# EAGLE design quadcopter (EAGLE 8.1.1)
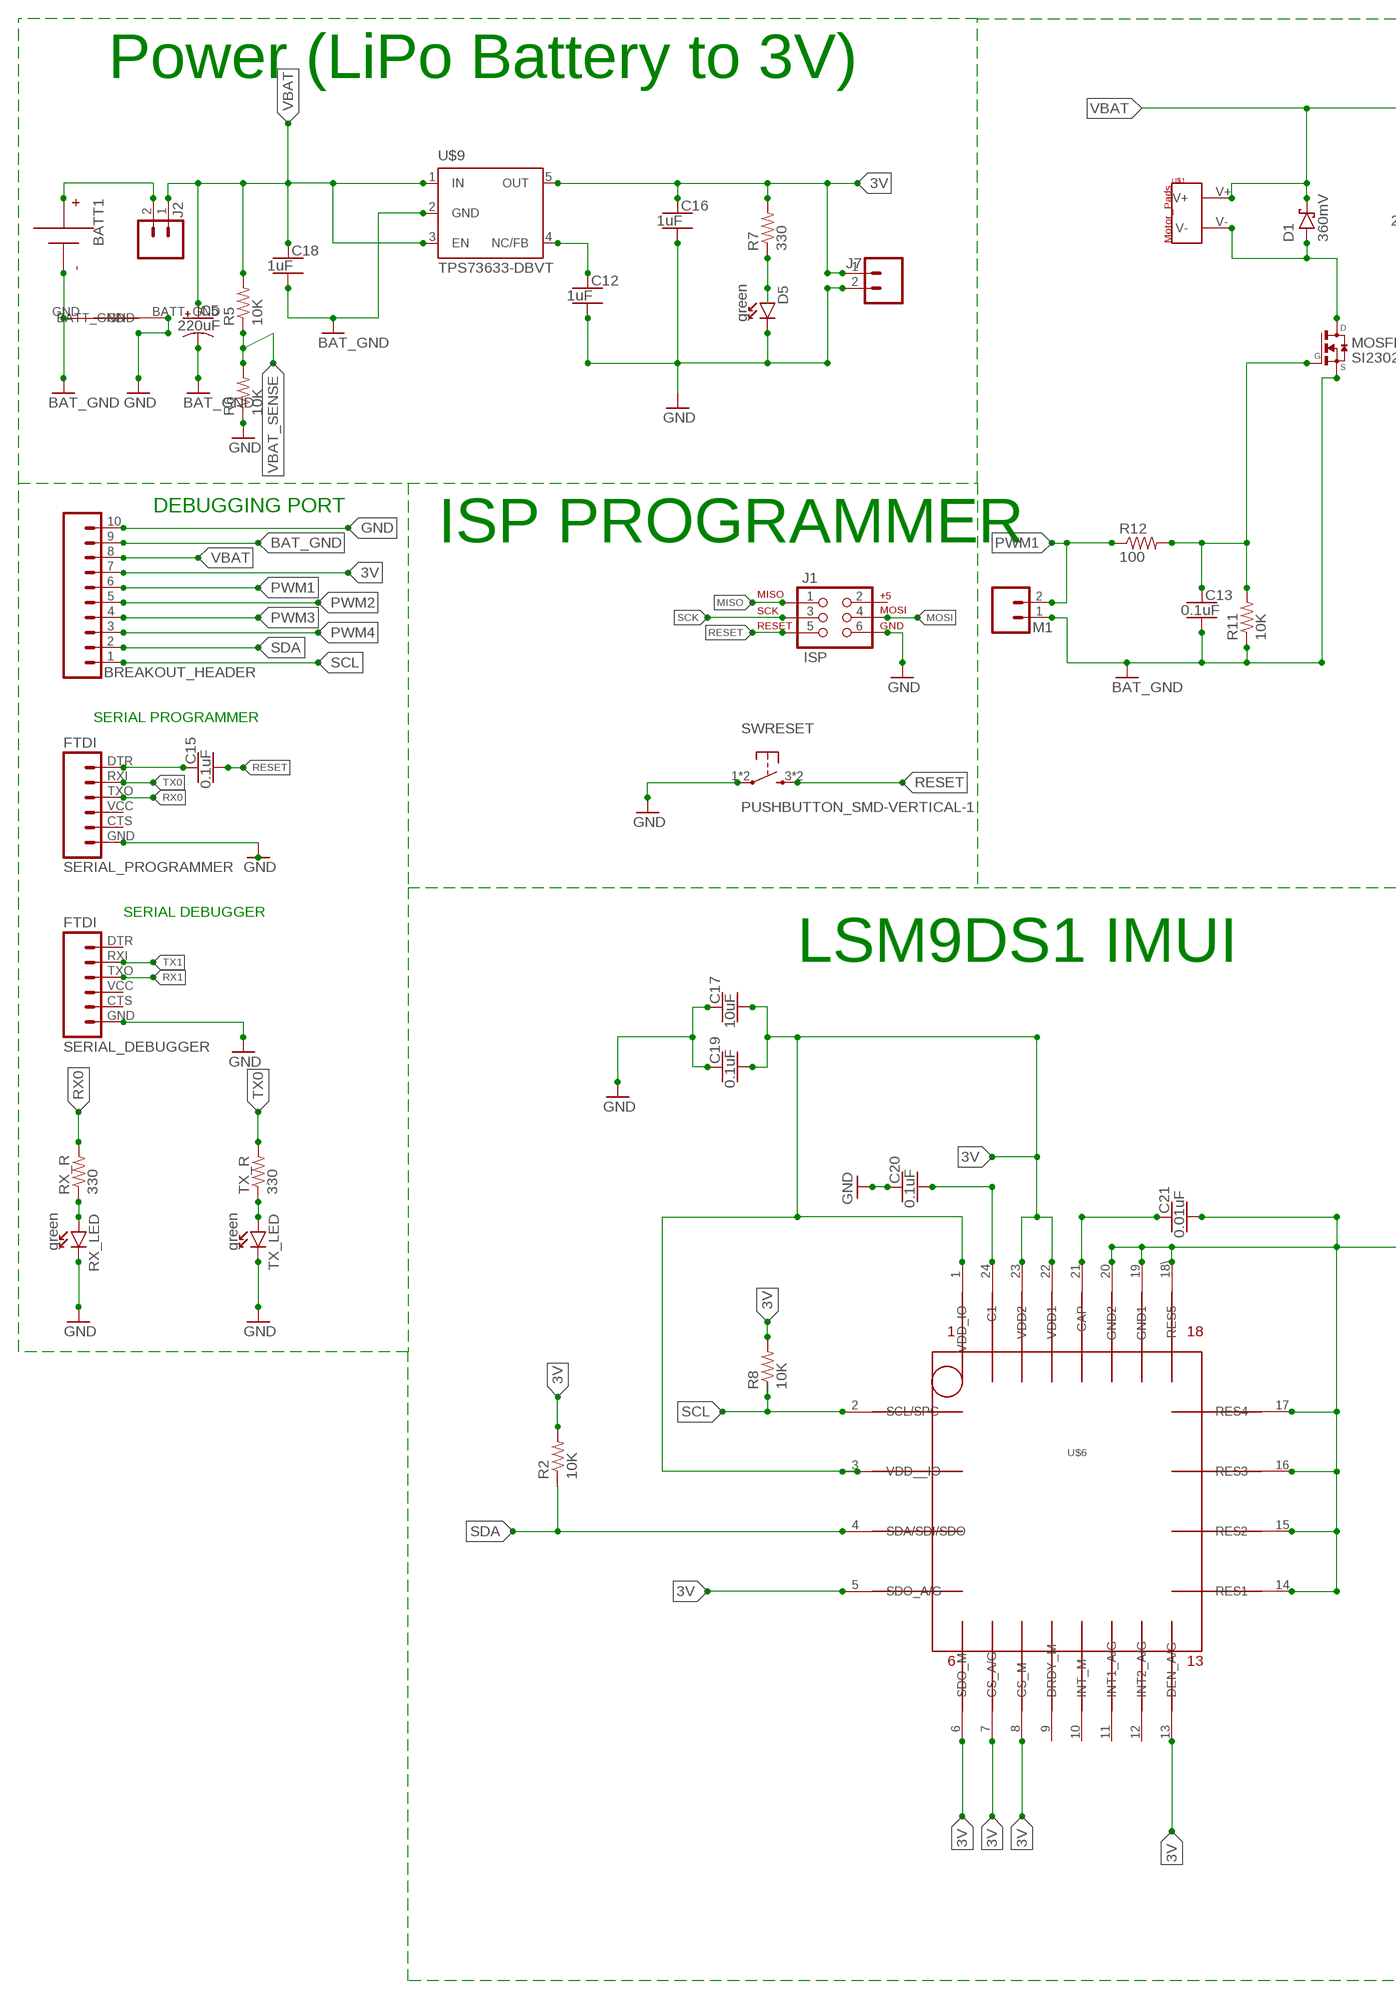
[diagram p0: schematic, sheet 1, part 1 of 2]
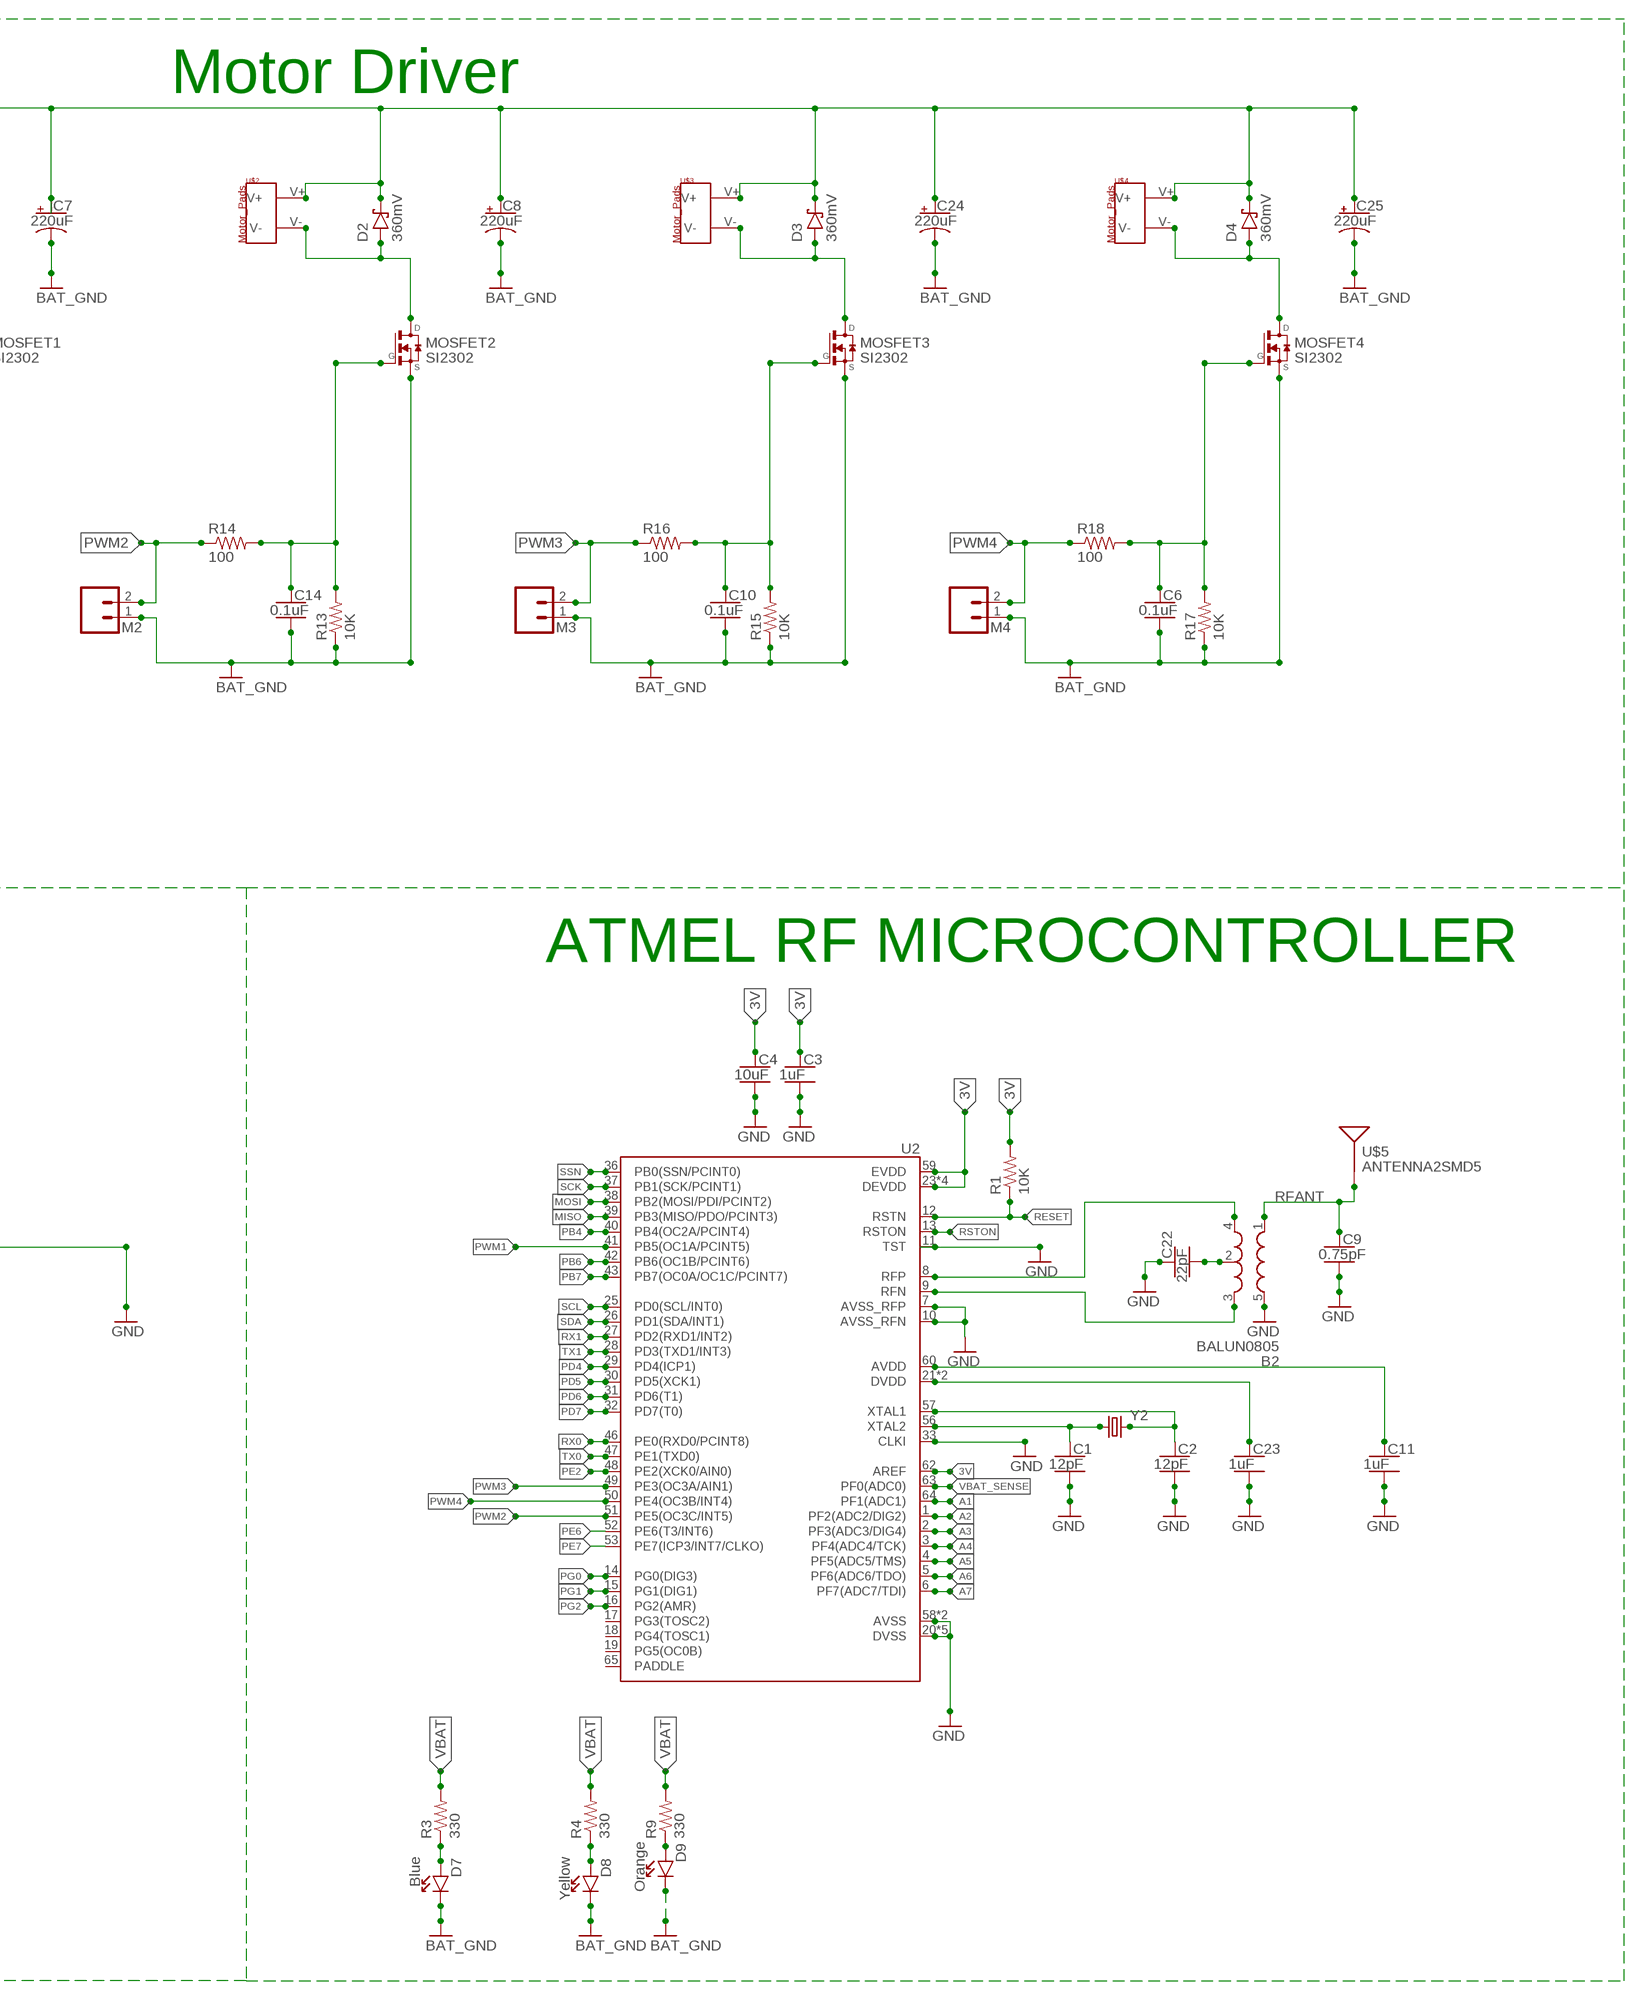
[diagram p1: schematic, sheet 1, part 2 of 2]

## Parts
B2  BALUN0805  [BALUN]
BATT1  BATTERY-HUBSAN-W/HOLDER  [BATTERY-W/HOLDER-380MAH-HUBSAN]
BREAKOUT_HEADER  SIP-10_TH-254X10  [HDRV10W63P254_10X1_2540X254H838_HS]
C1  12pF  CAPACITOR-NP_SMD-2012-0805_CERAMIC-12PF  [CAPC2012X140_HS]
C2  12pF  CAPACITOR-NP_SMD-2012-0805_CERAMIC-12PF  [CAPC2012X140_HS]
C3  1uF  CAPACITOR-NP_SMD-2012-0805_CERAMIC-1UF  [CAPC2012X140_HS]
C4  10uF  CAPACITOR-NP_SMD-2012-0805_CERAMIC-10UF  [CAPC2012X140_HS]
C5  220uF  CAPACITOR-POL_SMD-7043-D_TANTALUM-220UF  [CAPMP7343X310_HS]
C6  0.1uF  CAPACITOR-NP_SMD-2012-0805_CERAMIC-0.1UF  [CAPC2012X140_HS]
C7  220uF  CAPACITOR-POL_SMD-7043-D_TANTALUM-220UF  [CAPMP7343X310_HS]
C8  220uF  CAPACITOR-POL_SMD-7043-D_TANTALUM-220UF  [CAPMP7343X310_HS]
C9  0.75pF  CAPACITOR-NP_SMD-2012-0805_CERAMIC-0.75PF  [CAPC2012X140_HS]
C10  0.1uF  CAPACITOR-NP_SMD-2012-0805_CERAMIC-0.1UF  [CAPC2012X140_HS]
C11  1uF  CAPACITOR-NP_SMD-2012-0805_CERAMIC-1UF  [CAPC2012X140_HS]
C12  1uF  CAPACITOR-NP_SMD-2012-0805_CERAMIC-1UF  [CAPC2012X140_HS]
C13  0.1uF  CAPACITOR-NP_SMD-2012-0805_CERAMIC-0.1UF  [CAPC2012X140_HS]
C14  0.1uF  CAPACITOR-NP_SMD-2012-0805_CERAMIC-0.1UF  [CAPC2012X140_HS]
C15  0.1uF  CAPACITOR-NP_SMD-2012-0805_CERAMIC-0.1UF  [CAPC2012X140_HS]
C16  1uF  CAPACITOR-NP_SMD-2012-0805_CERAMIC-1UF  [CAPC2012X140_HS]
C17  10uF  CAPACITOR-NP_SMD-2012-0805_CERAMIC-10UF  [CAPC2012X140_HS]
C18  1uF  CAPACITOR-NP_SMD-2012-0805_CERAMIC-1UF  [CAPC2012X140_HS]
C19  0.1uF  CAPACITOR-NP_SMD-2012-0805_CERAMIC-0.1UF  [CAPC2012X140_HS]
C20  0.1uF  CAPACITOR-NP_SMD-2012-0805_CERAMIC-0.1UF  [CAPC2012X140_HS]
C21  0.01uF  CAPACITOR-NP_SMD-2012-0805_CERAMIC-0.01UF  [CAPC2012X140_HS]
C22  22pF  CAPACITOR-NP_SMD-2012-0805_CERAMIC-22PF  [CAPC2012X140_HS]
C23  1uF  CAPACITOR-NP_SMD-2012-0805_CERAMIC-1UF  [CAPC2012X140_HS]
C24  220uF  CAPACITOR-POL_SMD-7043-D_TANTALUM-220UF  [CAPMP7343X310_HS]
C25  220uF  CAPACITOR-POL_SMD-7043-D_TANTALUM-220UF  [CAPMP7343X310_HS]
D1  360mV  DIODE-SCHOTTKY_SMD-SOD123-360MV  [SOD3716X135_HS]
D2  360mV  DIODE-SCHOTTKY_SMD-SOD123-360MV  [SOD3716X135_HS]
D3  360mV  DIODE-SCHOTTKY_SMD-SOD123-360MV  [SOD3716X135_HS]
D4  360mV  DIODE-SCHOTTKY_SMD-SOD123-360MV  [SOD3716X135_HS]
D5  green  DIODE-LED_SMD-2012-0805-GREEN  [LEDSC125X200X120-2_HS]
D7  Blue  DIODE-LED_SMD-2012-0805  [LEDSC125X200X120-2_HS]
D8  Yellow  DIODE-LED_SMD-2012-0805  [LEDSC125X200X120-2_HS]
D9  Orange  DIODE-LED_SMD-2012-0805  [LEDSC125X200X120-2_HS]
J1  ISP  AVR_SPI_PRG_6NS  [2X3-NS]
J2  MALE_HEADER_2POS-2X1-0.1IN  [MALE_HEADER_2X1_0.1IN]
J7  MALE_HEADER_2POS-2X1-0.1IN  [MALE_HEADER_2X1_0.1IN]
M1  MALE_HEADER_2POS-2X1-0.1IN  [MALE_HEADER_2X1_0.1IN]
M2  MALE_HEADER_2POS-2X1-0.1IN  [MALE_HEADER_2X1_0.1IN]
M3  MALE_HEADER_2POS-2X1-0.1IN  [MALE_HEADER_2X1_0.1IN]
M4  MALE_HEADER_2POS-2X1-0.1IN  [MALE_HEADER_2X1_0.1IN]
MOSFET1  SI2302  [SOT23]
MOSFET2  SI2302  [SOT23]
MOSFET3  SI2302  [SOT23]
MOSFET4  SI2302  [SOT23]
R1  10K  RESISTOR_SMD-2012-0805-10K  [RESC2012X60_HS]
R2  10K  RESISTOR_SMD-2012-0805-10K  [RESC2012X60_HS]
R3  330  RESISTOR_SMD-2012-0805-330  [RESC2012X60_HS]
R4  330  RESISTOR_SMD-2012-0805-330  [RESC2012X60_HS]
R5  10K  RESISTOR_SMD-2012-0805-10K  [RESC2012X60_HS]
R6  10K  RESISTOR_SMD-2012-0805-10K  [RESC2012X60_HS]
R7  330  RESISTOR_SMD-2012-0805-330  [RESC2012X60_HS]
R8  10K  RESISTOR_SMD-2012-0805-10K  [RESC2012X60_HS]
R9  330  RESISTOR_SMD-2012-0805-330  [RESC2012X60_HS]
R11  10K  RESISTOR_SMD-2012-0805-10K  [RESC2012X60_HS]
R12  100  RESISTOR_SMD-2012-0805-100  [RESC2012X60_HS]
R13  10K  RESISTOR_SMD-2012-0805-10K  [RESC2012X60_HS]
R14  100  RESISTOR_SMD-2012-0805-100  [RESC2012X60_HS]
R15  10K  RESISTOR_SMD-2012-0805-10K  [RESC2012X60_HS]
R16  100  RESISTOR_SMD-2012-0805-100  [RESC2012X60_HS]
R17  10K  RESISTOR_SMD-2012-0805-10K  [RESC2012X60_HS]
R18  100  RESISTOR_SMD-2012-0805-100  [RESC2012X60_HS]
RX_LED  green  DIODE-LED_SMD-2012-0805-GREEN  [LEDSC125X200X120-2_HS]
RX_R  330  RESISTOR_SMD-2012-0805-330  [RESC2012X60_HS]
SERIAL_DEBUGGER  FTDI  FTDI_BASICPTH  [FTDI_BASIC]
SERIAL_PROGRAMMER  FTDI  FTDI_BASICPTH  [FTDI_BASIC]
SWRESET  PUSHBUTTON_SMD-VERTICAL-1  [TE_FSM8JSMA_HS]
TX_LED  green  DIODE-LED_SMD-2012-0805-GREEN  [LEDSC125X200X120-2_HS]
TX_R  330  RESISTOR_SMD-2012-0805-330  [RESC2012X60_HS]
U2  ATMEGA128RFA1  [QFN-64]
U$1  MOTOR_PADS  [MOTOR_PADS]
U$2  MOTOR_PADS  [MOTOR_PADS]
U$3  MOTOR_PADS  [MOTOR_PADS]
U$4  MOTOR_PADS  [MOTOR_PADS]
U$5  ANTENNA2SMD5  [ANTENNA-CHIP5]
U$6  IMULAST  [LGA-24/4MM]
U$7  WIRE_BRIDGE  [WIRE_BRIGE]
U$9  TPS73633-DBVT  [SOT23-DBV]
Y2  CRYSTAL5X3  [CRYSTAL-SMD-5X3]

## Nets
3V: BREAKOUT_HEADER.7 C3.1 C4.1 C16.1 C17.2 C19.2 J7.1 R1.2 R2.2 R7.2 R8.2 U2.23(DEVDD) U2.34(DEVDD) U2.44(DEVDD) U2.54(DEVDD) U2.59(EVDD) U2.62(AREF) U$6.1(VDD_IO) U$6.3(VDD__IO) U$6.5(SDO_A/G) U$6.6(SDO_M) U$6.7(CS_A/G) U$6.8(CS_M) U$6.13(DEN_A/G) U$6.22(VDD1) U$6.23(VDD2) U$9.5(OUT)
A1: U2.64(PF1(ADC1))
A2: U2.1(PF2(ADC2/DIG2))
A3: U2.2(PF3(ADC3/DIG4))
A4: U2.3(PF4(ADC4/TCK))
A5: U2.4(PF5(ADC5/TMS))
A6: U2.5(PF6(ADC6/TDO))
A7: U2.6(PF7(ADC7/TDI))
AVDD: C11.1 U2.60(AVDD)
BAT_GND [RFSIG]: BATT1.-(N) BREAKOUT_HEADER.9 C5.2(-) C6.2 C7.2(-) C8.2(-) C10.2 C13.2 C14.2 C18.2 C24.2(-) C25.2(-) D7.C D8.C D9.C M1.1 M2.1 M3.1 M4.1 MOSFET1.2(S) MOSFET2.2(S) MOSFET3.2(S) MOSFET4.2(S) R11.1 R13.1 R15.1 R17.1 U$7.GND U$9.2(GND)
DTR: C15.1 SERIAL_PROGRAMMER.DTR
DVDD: C23.1 U2.21(DVDD) U2.22(DVDD)
GND [HighAmps]: B2.5(GND) BREAKOUT_HEADER.10 C1.2 C2.2 C3.2 C4.2 C9.2 C11.2 C12.2 C16.2 C17.1 C19.1 C20.1 C21.2 C22.1 C23.2 D5.C J1.6 J7.2 R6.1 RX_LED.C SERIAL_DEBUGGER.GND SERIAL_PROGRAMMER.GND SWRESET.1 SWRESET.2 TX_LED.C U2.7(AVSS_RFP) U2.10(AVSS_RFN) U2.11(TST) U2.20(DVSS) U2.24(DVSS) U2.33(CLKI) U2.35(DVSS) U2.45(DVSS) U2.55(DVSS) U2.58(AVSS) U2.61(AVSS) U$6.14(RES1) U$6.15(RES2) U$6.16(RES3) U$6.17(RES4) U$6.18\(RES5) U$6.19(GND1) U$6.20(GND2) U$7.BATT_GND
MISO: J1.1 U2.39(PB3(MISO/PDO/PCINT3))
MOSI: J1.4 U2.38(PB2(MOSI/PDI/PCINT2))
N$2 [HighAmps]: C13.1 MOSFET1.1(G) R11.2 R12.2
N$3: C2.1 U2.57(XTAL1) Y2.3
N$4: C1.1 U2.56(XTAL2) Y2.1
N$7 [HighAmps]: B2.2(GND) C22.2
N$9: D9.A R9.1
N$14 [HighAmps]: D1.A MOSFET1.3(D) U$1.V-
N$17 [RFSIG]: BATT1.+(P) J2.2
N$18: D5.A R7.1
N$19 [HighAmps]: D2.A MOSFET2.3(D) U$2.V-
N$21: TX_LED.A TX_R.1
N$22: RX_LED.A RX_R.1
N$23: C20.2 U$6.24(C1)
N$24 [HighAmps]: D3.A MOSFET3.3(D) U$3.V-
N$26: C12.1 U$9.4(NC/FB)
N$27: D8.A R4.1
N$28: D7.A R3.1
N$29 [HighAmps]: D4.A MOSFET4.3(D) U$4.V-
N$33: C21.1 U$6.21(CAP)
N$48 [RFSIG]: C14.1 MOSFET2.1(G) R13.2 R14.2
N$50: C10.1 MOSFET3.1(G) R15.2 R16.2
N$52 [RFSIG]: C6.1 MOSFET4.1(G) R17.2 R18.2
PB4: U2.40(PB4(OC2A/PCINT4))
PB6: U2.42(PB6(OC1B/PCINT6))
PB7: U2.43(PB7(OC0A/OC1C/PCINT7))
PD4: U2.29(PD4(ICP1))
PD5: U2.30(PD5(XCK1))
PD6: U2.31(PD6(T1))
PD7: U2.32(PD7(T0))
PE2: U2.48(PE2(XCK0/AIN0))
PE6: U2.52(PE6(T3/INT6))
PE7: U2.53(PE7(ICP3/INT7/CLKO))
PG0: U2.14(PG0(DIG3))
PG1: U2.15(PG1(DIG1))
PG2: U2.16(PG2(AMR))
PWM1: BREAKOUT_HEADER.6 M1.2 R12.1 U2.41(PB5(OC1A/PCINT5))
PWM2: BREAKOUT_HEADER.5 M2.2 R14.1 U2.51(PE5(OC3C/INT5))
PWM3: BREAKOUT_HEADER.4 M3.2 R16.1 U2.49(PE3(OC3A/AIN1))
PWM4: BREAKOUT_HEADER.3 M4.2 R18.1 U2.50(PE4(OC3B/INT4))
RESET: C15.2 J1.5 R1.1 SWRESET.3 SWRESET.4 U2.12(RSTN)
RFANT [RFSIG]: B2.1(IN) C9.1 U$5.FEED(SIGNAL)
RFN [HighAmps]: B2.3(OUT2) U2.9(RFN)
RFP [HighAmps]: B2.4(OUT1) U2.8(RFP)
RSTON: U2.13(RSTON)
RX0: RX_R.2 SERIAL_PROGRAMMER.TXO U2.46(PE0(RXD0/PCINT8))
RX1: SERIAL_DEBUGGER.TXO U2.27(PD2(RXD1/INT2))
SCK: J1.3 U2.37(PB1(SCK/PCINT1))
SCL: BREAKOUT_HEADER.1 R8.1 U2.25(PD0(SCL/INT0)) U$6.2(SCL/SPC)
SDA: BREAKOUT_HEADER.2 R2.1 U2.26(PD1(SDA/INT1)) U$6.4(SDA/SDI/SDO)
SSN: U2.36(PB0(SSN/PCINT0))
TX0: SERIAL_PROGRAMMER.RXI TX_R.2 U2.47(PE1(TXD0))
TX1: SERIAL_DEBUGGER.RXI U2.28(PD3(TXD1/INT3))
VBAT [RFSIG]: BREAKOUT_HEADER.8 C5.1(+) C7.1(+) C8.1(+) C18.1 C24.1(+) C25.1(+) D1.C D2.C D3.C D4.C J2.1 R3.2 R4.2 R5.2 R9.2 U$1.V+ U$2.V+ U$3.V+ U$4.V+ U$9.1(IN) U$9.3(EN)
VBAT_SENSE [RFSIG]: R5.1 R6.2 U2.63(PF0(ADC0))
Unconnected: J1.2 SERIAL_DEBUGGER.CTS SERIAL_DEBUGGER.DTR SERIAL_DEBUGGER.VCC SERIAL_PROGRAMMER.CTS SERIAL_PROGRAMMER.VCC U2.17(PG3(TOSC2)) U2.18(PG4(TOSC1)) U2.19(PG5(OC0B)) U2.65(PADDLE) U$6.9(DRDY_M) U$6.10(INT_M) U$6.11(INT1_A/G) U$6.12(INT2_A/G)

## Notes on the sheet
- Power (LiPo Battery to 3V) | Motor Driver
- DEBUGGING PORT
- ISP PROGRAMMER
- SERIAL PROGRAMMER
- SERIAL DEBUGGER
- LSM9DS1 IMUI | ATMEL RF MICROCONTROLLER

## Library data of the parts
B2 = quadparts_prebuilt:BALUN: 0805 footprint balun- Ember 351/357; DATASHEET: http://katalog.we-online.de/pbs/datasheet/748421245.pdf; DIST: Digikey; DISTPN: 732-2230-6-ND; MFR: Wurth Electronics Inc; MPN: 748421245; PRICE: 2.63
BATT1 = quadparts_prebuilt:BATTERY; CREATOR: Swanson; DIST: AMAZON; DISTPN: http://www.amazon.com/dp/B00RROB6Q4?smid=AMNTPWSAB5H0S; MFR: HUBSAN; MPN: X4-H107C-8-in-1
BREAKOUT_HEADER = quadparts_prebuilt:SIP-10_: 10 pin single inline pin header, socket, or connector; DATASHEET: http://portal.fciconnect.com/Comergent//fci/drawing/68000.pdf; DIST: Digikey; DISTPN: 609-3250-ND; MFR: Amphenol FCI; MPN: 68000-110HLF; PRICE: 0.55
C1 C2 = quadparts_prebuilt:CAPACITOR-NP_: Nonpolarized capacitor; DIST: Digikey; DISTPN: 490-5531-1-ND; MFR: Murata Electronics North America; MPN: GRM21A5C2E120JW01D
C3 C11 C12 C16 C18 C23 = quadparts_prebuilt:CAPACITOR-NP_: Nonpolarized capacitor; DIST: Digikey; DISTPN: 490-4736-1-ND; MFR: Murata Electronics North America; MPN: GRM21BR71H105KA12L
C4 C17 = quadparts_prebuilt:CAPACITOR-NP_: Nonpolarized capacitor; DIST: Digikey; DISTPN: 490-5523-1-ND; MFR: Murata Electronics North America; MPN: GRM21BR61E106KA73L
C5 C7 C8 C24 C25 = quadparts_prebuilt:CAPACITOR-POL_: Polarized capacitor; DIST: Digikey; DISTPN: 478-8912-1-ND; MFR: AVX Corporation; MPN: TAJD227K006RNJ
C6 C10 C13-C15 C19 C20 = quadparts_prebuilt:CAPACITOR-NP_: Nonpolarized capacitor; DIST: Digikey; DISTPN: 490-1666-1-ND; MFR: Murata Electronics North America; MPN: GRM21BR71H104KA01L
C9 = quadparts_prebuilt:CAPACITOR-NP_: Nonpolarized capacitor; DIST: Digikey; DISTPN: 490-3585-1-ND; MFR: Murata Electronics North America; MPN: GQM2195C2AR75CB01D
C21 = quadparts_prebuilt:CAPACITOR-NP_: Nonpolarized capacitor; DIST: Digikey; DISTPN: 490-8295-1-ND; MFR: Murata Electronics North America; MPN: GRM2195C1H103FA01D
C22 = quadparts_prebuilt:CAPACITOR-NP_: Nonpolarized capacitor; DIST: Digikey; DISTPN: 490-5534-1-ND; MFR: Murata Electronics North America; MPN: GRM21A5C2E220JW01D
D1-D4 = quadparts_prebuilt:DIODE-SCHOTTKY_: Schottky diode; DIST: Digikey; DISTPN: CRS08QMCT-ND; MFR: Toshiba Semiconductor and Storage; MPN: CRS08(TE85L,Q,M)
D5 RX_LED TX_LED = quadparts_prebuilt:DIODE-LED_: Light emitting diode; DIST: Digikey; DISTPN: 160-1179-1-ND; MFR: Lite-On Inc; MPN: LTST-C170GKT
D7-D9 = quadparts_prebuilt:DIODE-LED_: Light emitting diode
J1 = SparkFun-Connectors:AVR_SPI_PRG_6: AVR ISP 6 Pin This is the reduced ISP connector for AVR programming. Common on Arduino. This footprint will take up less PCB space and can be used with a 10-pin to 6-pin adapter such as SKU: BOB-08508
J2 J7 M1-M4 = quadparts_prebuilt:MALE_HEADER_2POS: 2 pin single inline pin header, socket, or connector; CREATOR: SWANSON; DIST: Digikey; DISTPN: 3M9447-ND; MFR: 3M; MPN: 961102-6404-AR
MOSFET1-MOSFET4 = quadparts_prebuilt:SI2302: MOSFET N-Channel 20 V (D-S); AVAILABILITY: Good; DESCRIPTION: Single N-Channel 20 V 0.057 Ohm 0.71 W Surface Mount Power Mosfet - SOT-23-3; MF: Vishay Siliconix; MP: SI2302CDS-T1-E3; PACKAGE: SOT-23-3 Vishay Siliconix; PRICE: 0.19 USD
R1 R2 R5 R6 R8 R11 R13 R15 R17 = quadparts_prebuilt:RESISTOR_: Resistor; DIST: Digikey; DISTPN: 311-10KARCT-ND; MFR: Yageo; MPN: RC0805JR-0710KL
R3 R4 R7 R9 RX_R TX_R = quadparts_prebuilt:RESISTOR_: Resistor; DIST: Digikey; DISTPN: 311-330ARCT-ND; MFR: Yageo; MPN: RC0805JR-07330RL
R12 R14 R16 R18 = quadparts_prebuilt:RESISTOR_: Resistor; DIST: Digikey; DISTPN: 311-100ARCT-ND; MFR: Yageo; MPN: RC0805JR-07100RL
SERIAL_DEBUGGER SERIAL_PROGRAMMER = SparkFun-Connectors:FTDI_BASIC: FTDI Basic header with labels
SWRESET = quadparts_prebuilt:PUSHBUTTON_: Pushbutton with 2 pins shorting 1 to 2 and two extra mounting pins 3 & 4; DIST: Digikey; DISTPN: 450-1129-ND; MFR: TE Connectivity Alcoswitch Switches; MPN: FSM4JSMA
U2 = quadparts_prebuilt:ATMEGA128RFA1: ATmega128RFA1 8-bit AVR Microcontroller with Low Power 2.4GHz Transceiver for ZigBee and IEEE 802.15.4; CREATOR: Swanson; DATASHEET: http://www.atmel.com/Images/Atmel-8266-MCU_Wireless-ATmega128RFA1_Datasheet.pdf; DIST: Digikey; DISTPN: ATMEGA128RFA1-ZUR00DKR-ND; MFR: Atmel; MPN: ATMEGA128RFA1-ZUR00; PRICE: 10.21
U$1-U$4 = quadparts_prebuilt:MOTOR_PADS; DIST: NA; DISTPN: NA; MFR: NA; MPN: NA
U$5 = quadparts_prebuilt:ANTENNA2: Chip antenna Single endded antenna. Common with smaller chip antennas. CHIP4 package is the GPS Chip Antenna SKU: GPS-08418. CHIP5 package is 2.4GHz chip antenna SKU: WRL-00144.; DATASHEET: http://www.linxtechnologies.com/resources/data-guides/ant-xxx-chp-x.pdf; DIST: Digikey; DISTPN: ANT-2.45-CHPCT-ND; MFR: Linx Technologies Inc.; MPN: ANT-2.45-CHP-T; PRICE: 3.16
U$6 = QuadpartsUpdated:IMULAST
U$7 = QuadpartsUpdated:WIRE_BRIDGE
U$9 = quadparts_prebuilt:TPS73633-DBVT; DATASHEET: http://www.ti.com/lit/ds/symlink/lp3985.pdf; DIST: Digikey; DISTPN: LP3985IM5X-3.0/NOPBCT-ND; MFR: Texas Instruments; MPN: LP3985IM5X-3.0/NOPB; PRICE: 0.59
Y2 = quadparts_prebuilt:CRYSTAL: Various standard crystals. Proven footprints.; DATASHEET: http://www.abracon.com/Resonators/abm3b.pdf; DIST: Digikey; DISTPN: 535-9122-1-ND; MFR: Abracon LLC; MPN: ABM3B-16.000MHZ-B2-T; PRICE: 0.68; PROD_ID: XTAL-08218

## Net classes
1 HighAmps: width 0.762 mm
2 RFSIG: width 0.457 mm

## Board
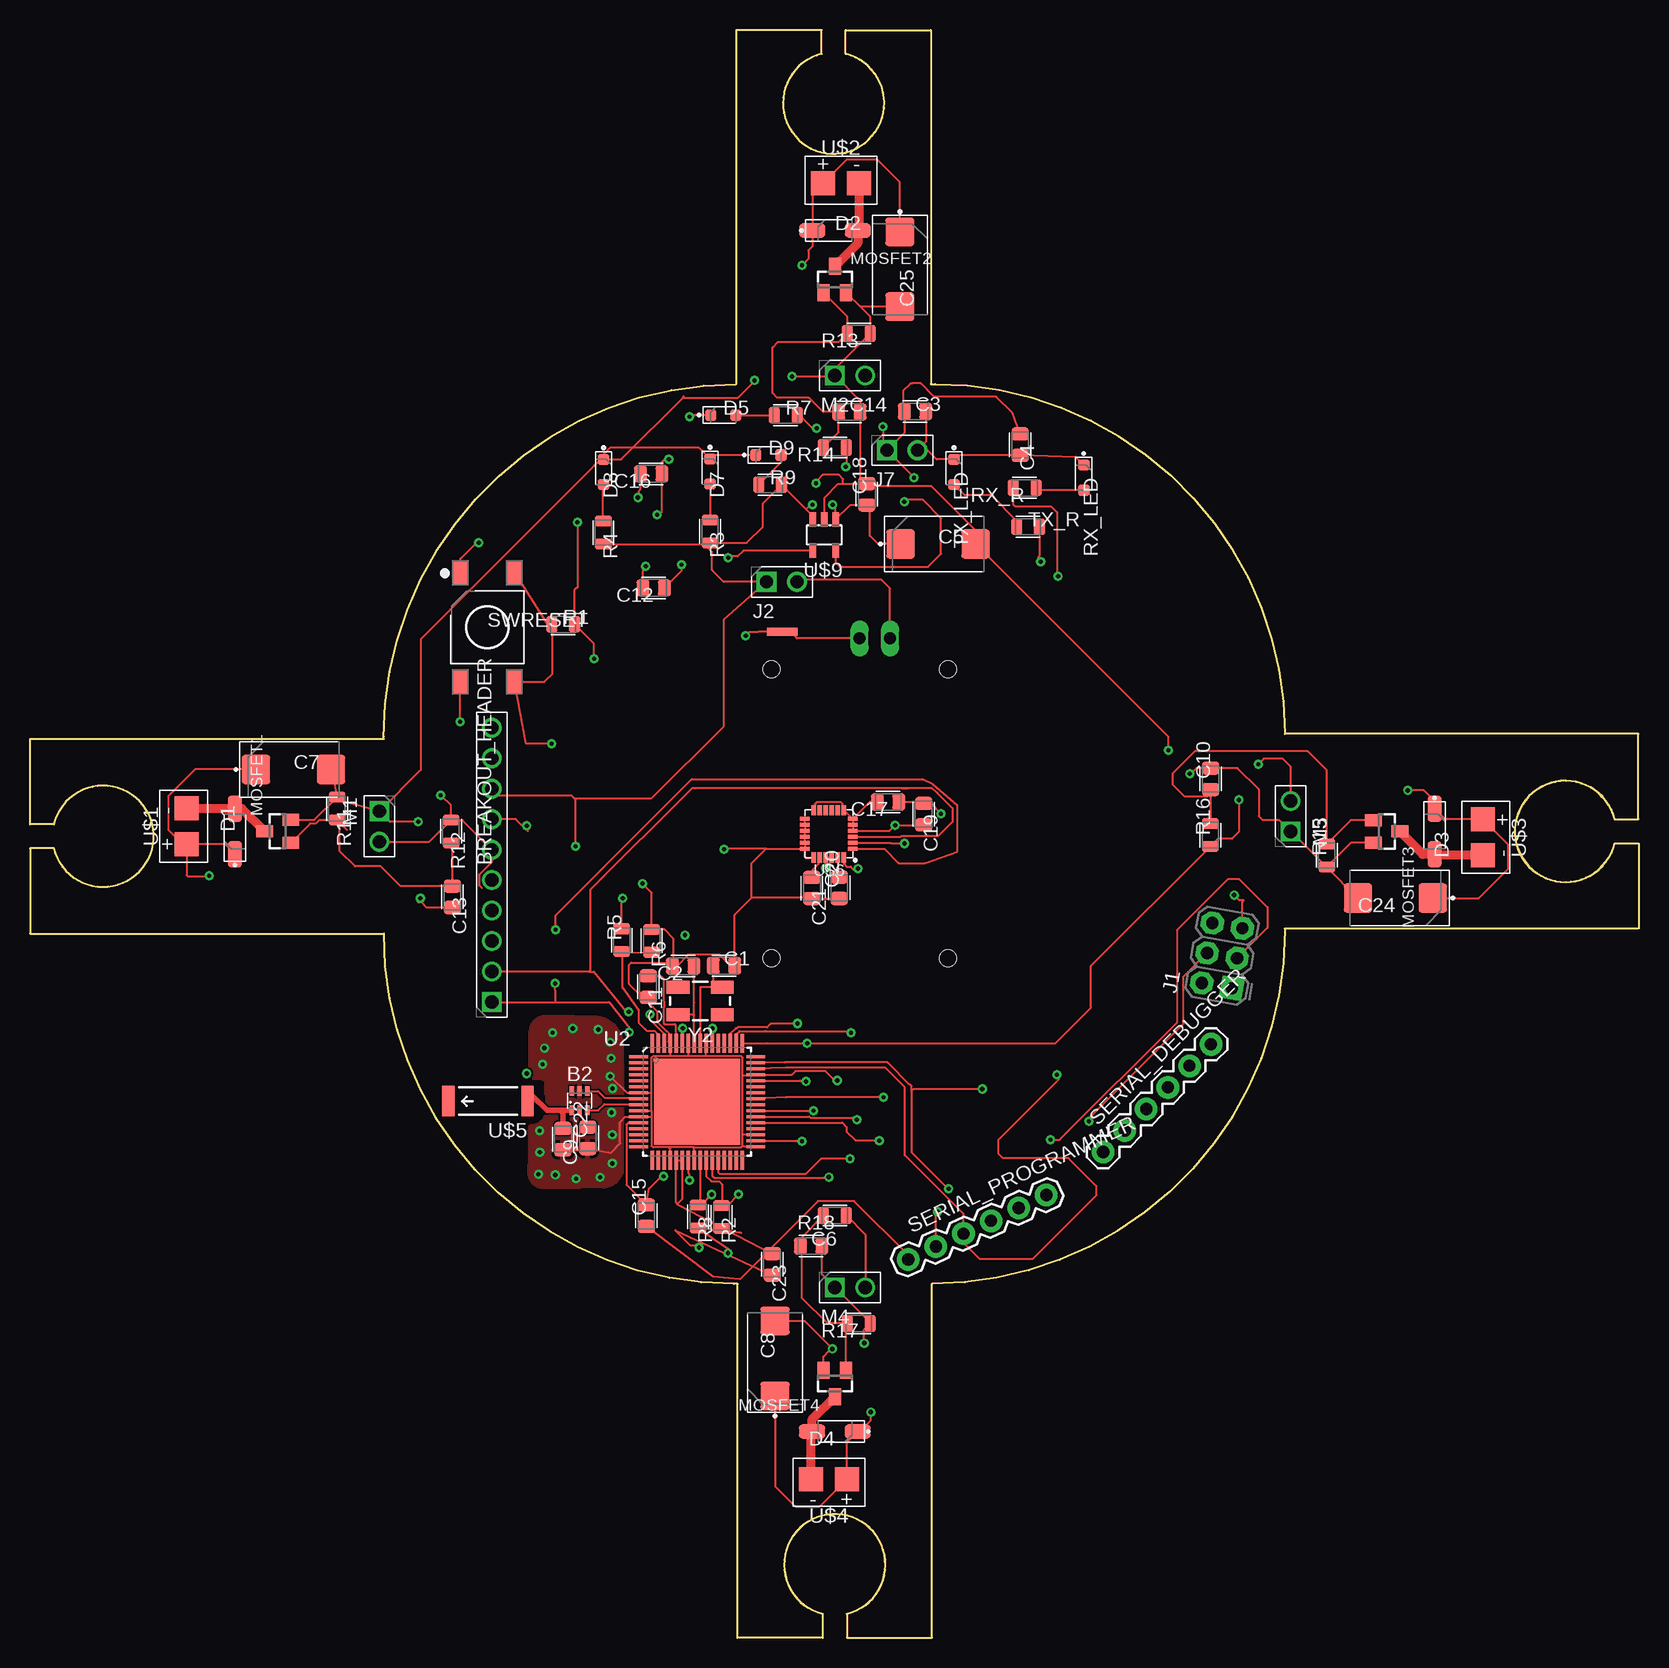
[diagram p2: board, top side]
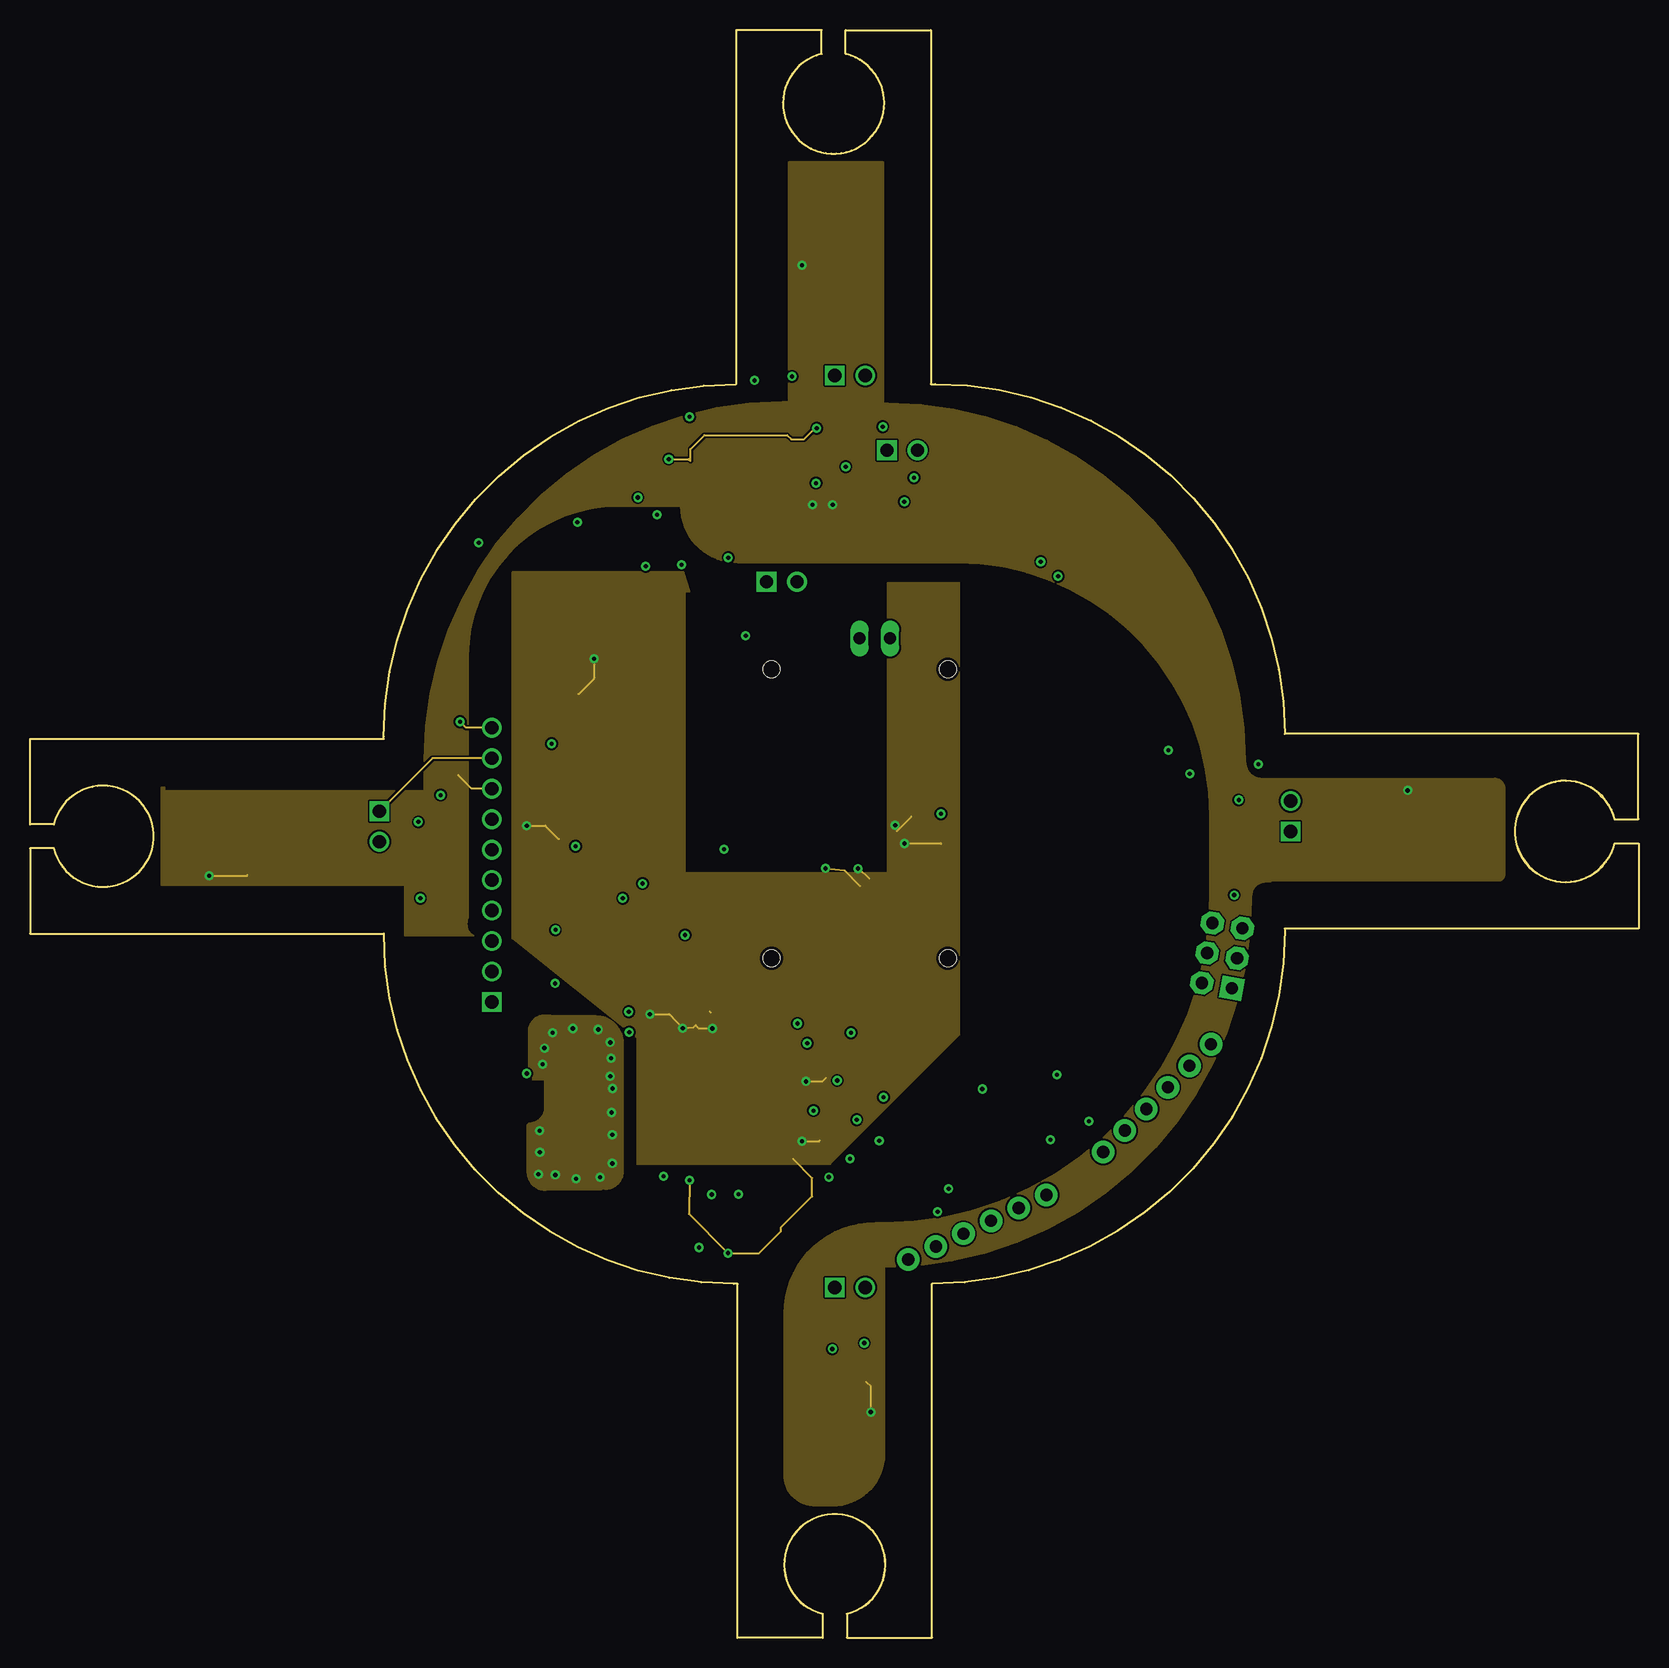
[diagram p3: board, inner layer Route2]
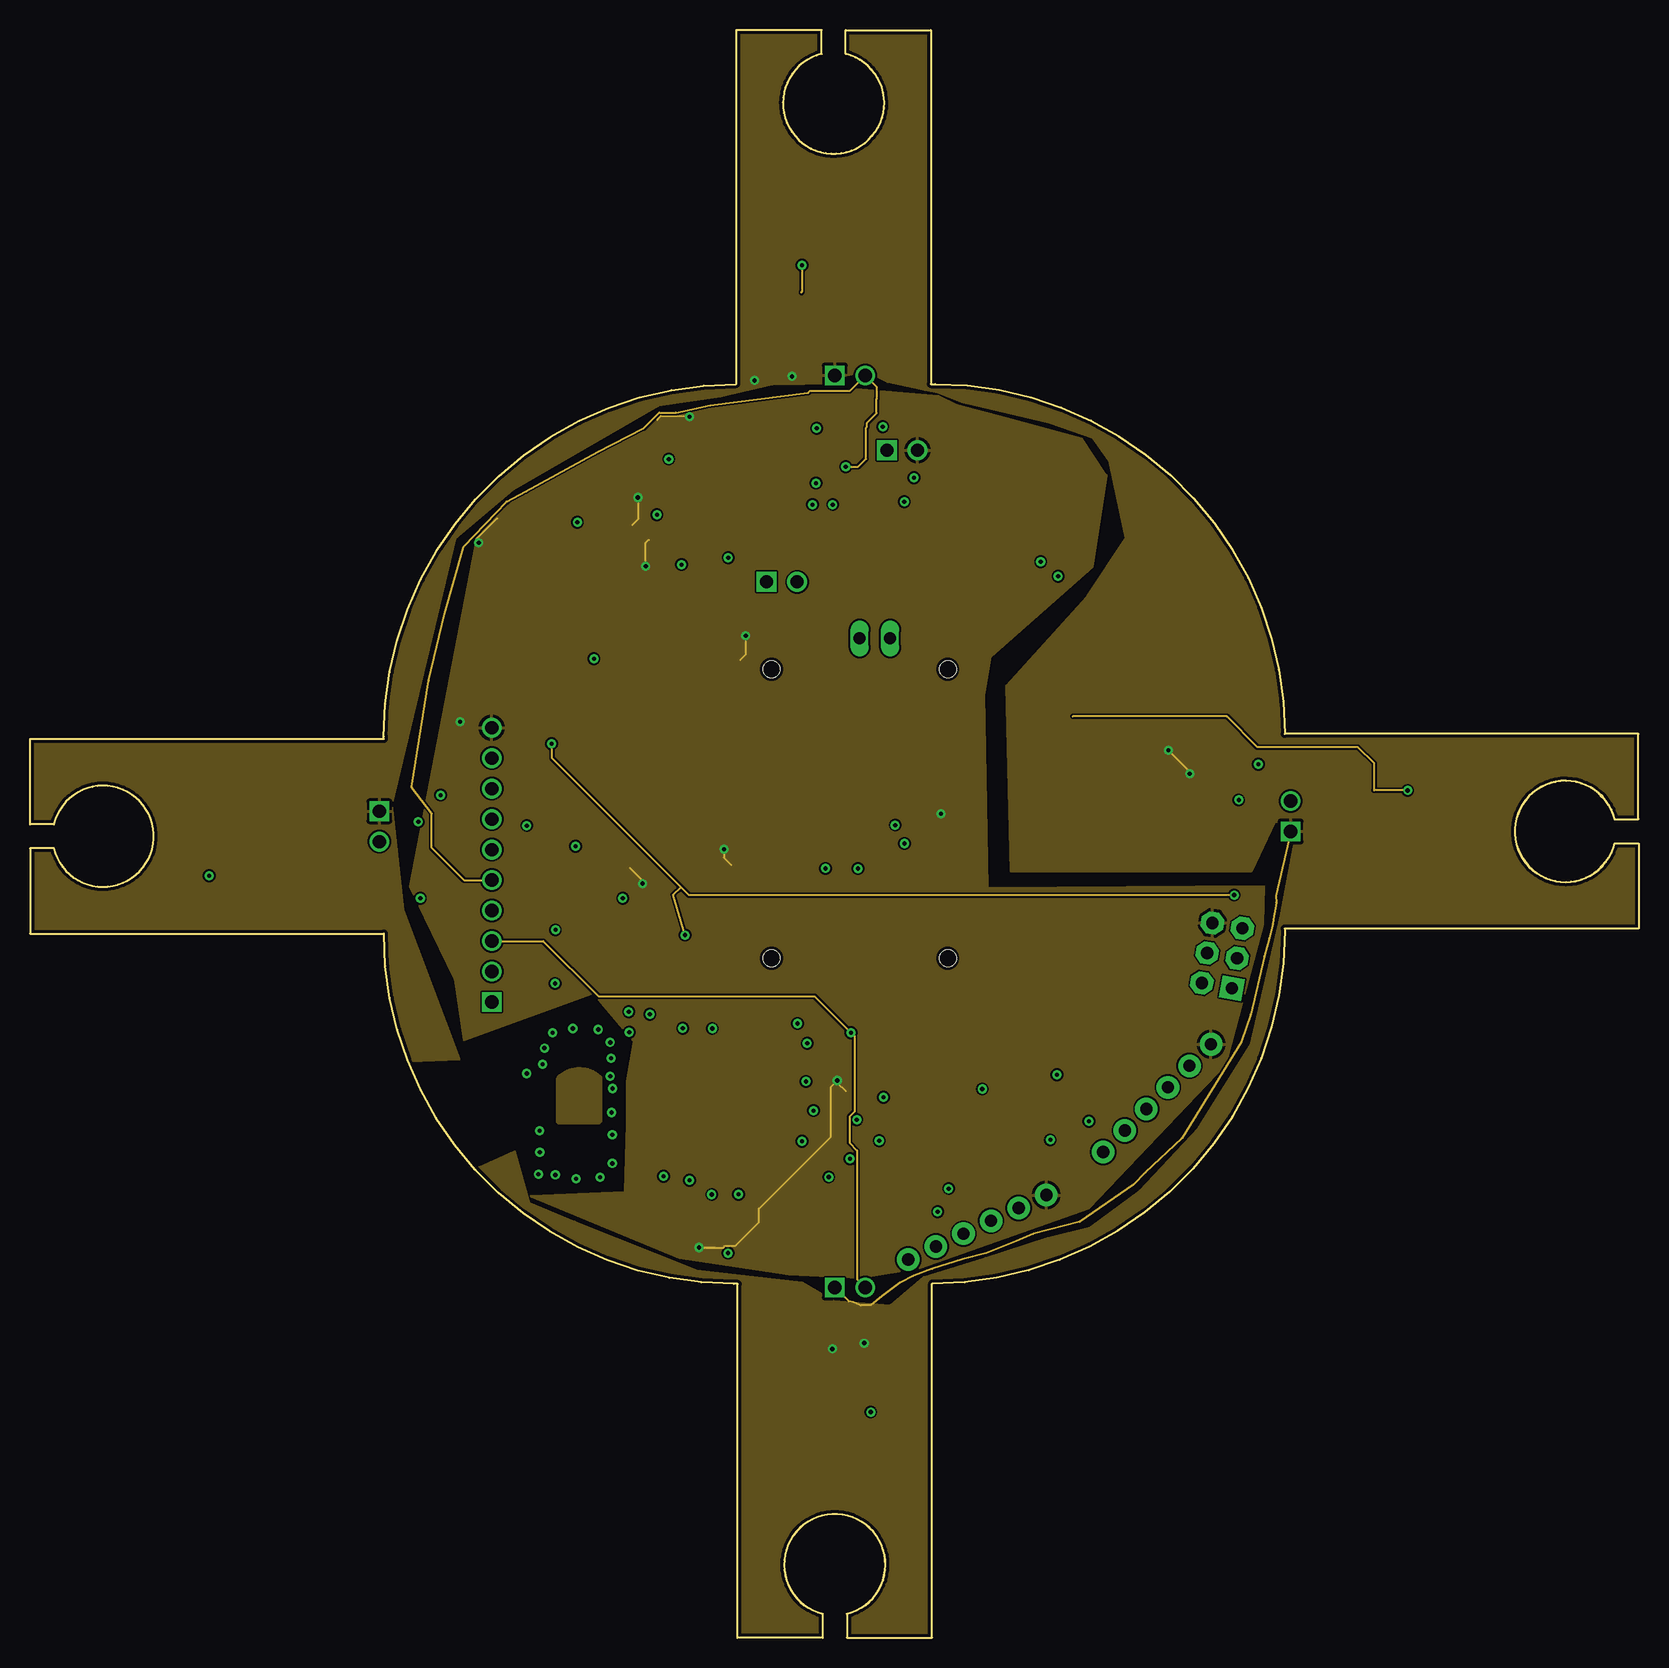
[diagram p4: board, inner layer Route15]
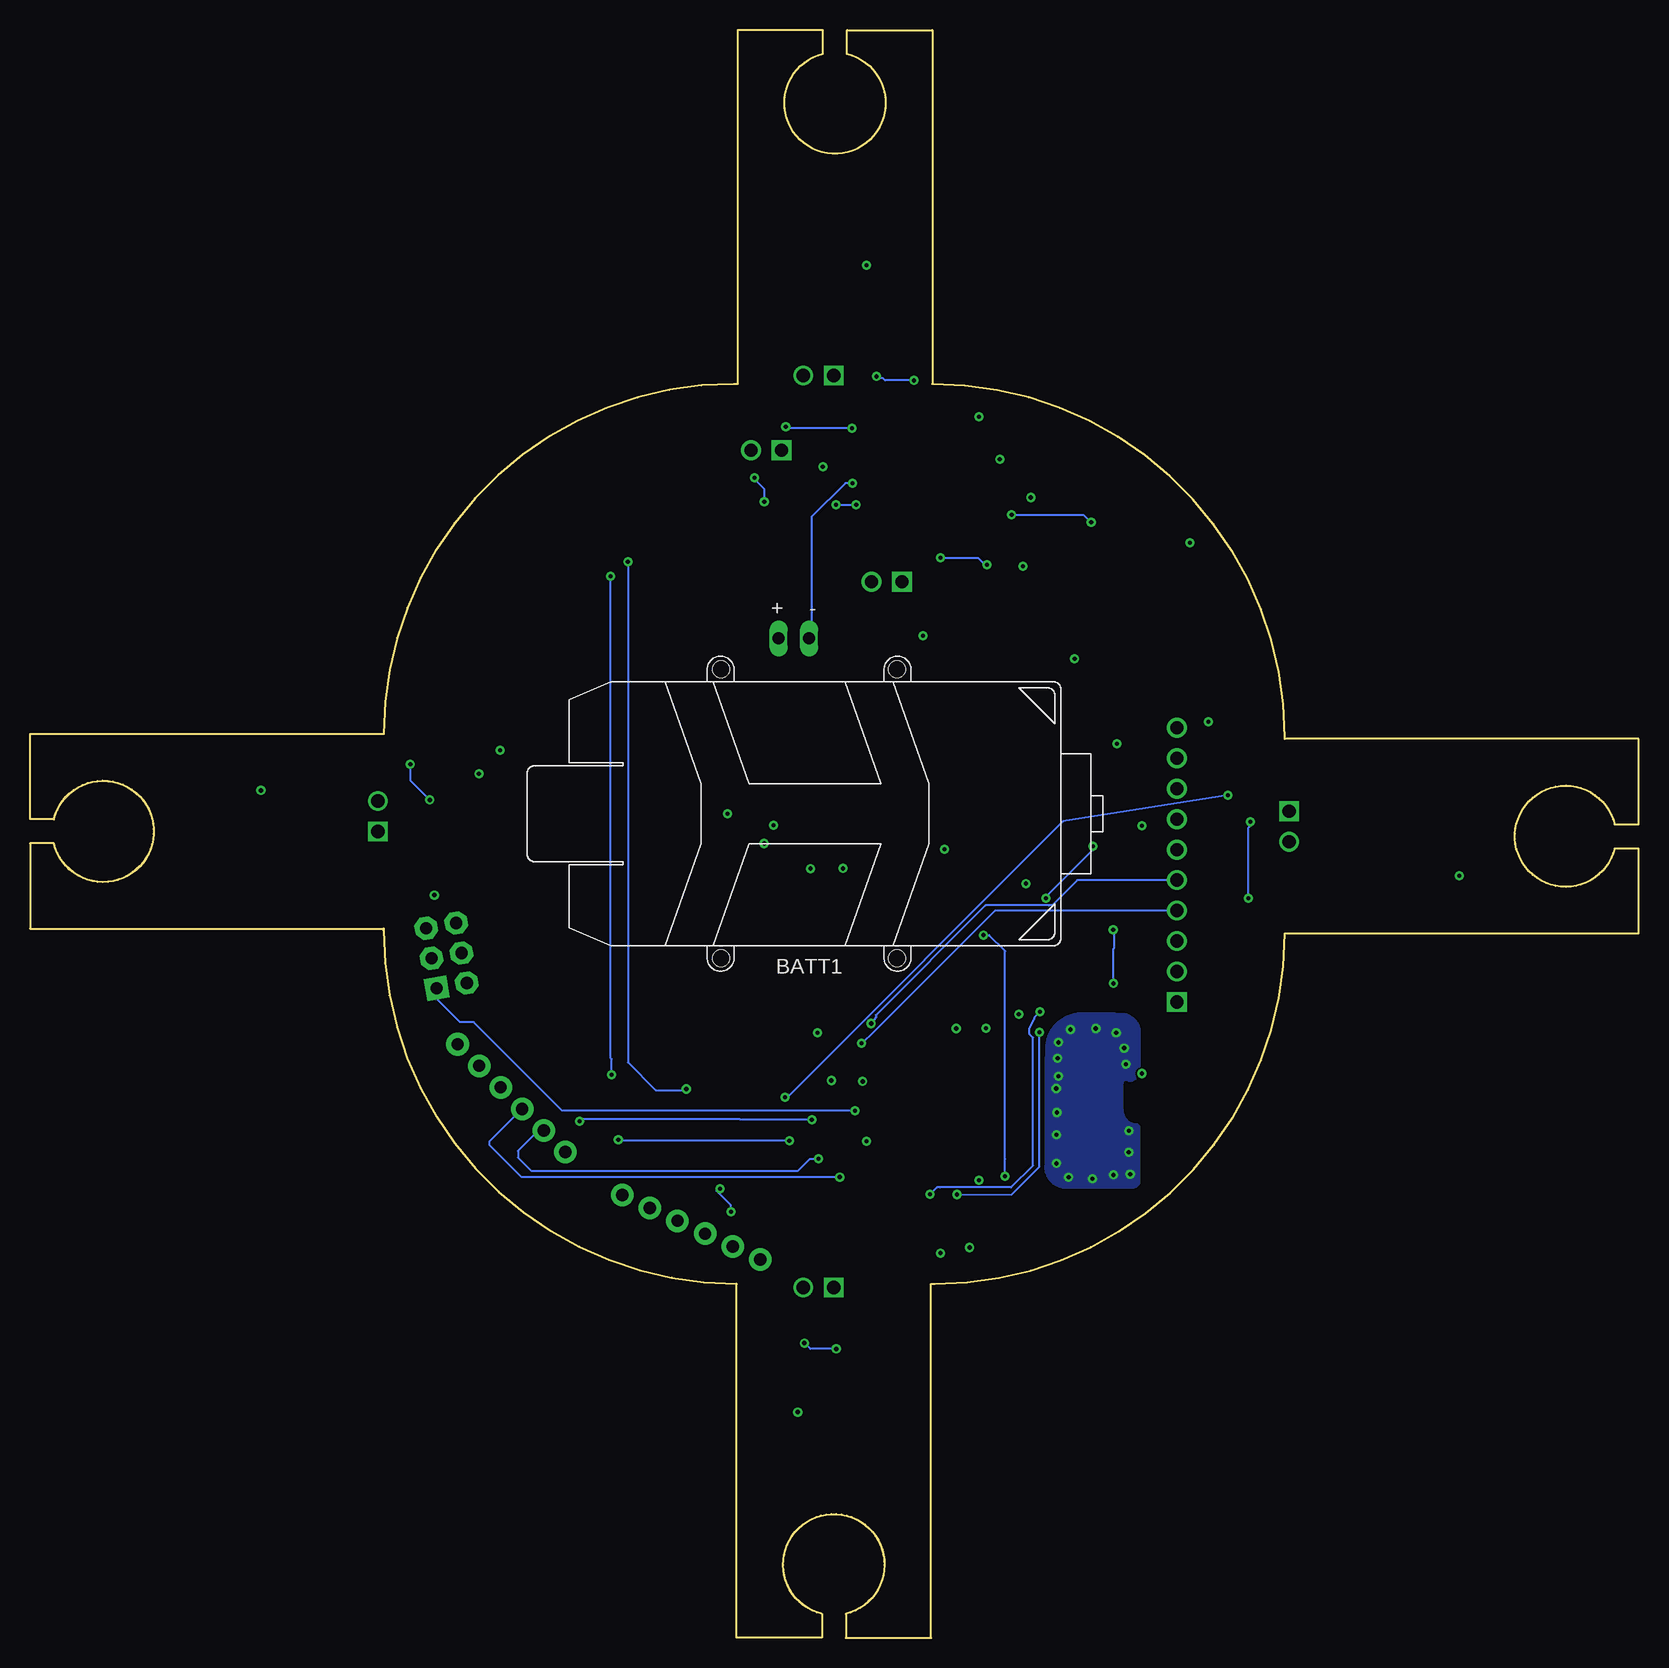
[diagram p5: board, bottom side, seen from below]

Size 134.09 x 133.98 mm. Coordinates in mm from the lower left corner, seen from the top.
Outline: 132.09,68.19 arc333 132.09,66.19
Outline: 65.99,131.99 arc333 67.99,131.99
Outline: 68.09,1.99 arc333 66.09,1.99
Outline: 68,132 67.99,132 67.99,133.98 75.1,133.98 75.1,104.49
Outline: 65.98,131.98 65.98,133.96 58.88,133.96
Outline: 58.87,133.96 58.87,104.48
Outline: 58.87,104.48 58.87,104.47
Outline: 132.1,68.2 arc333 132.1,66.2
Outline: 132.11,66.2 134.09,66.2 134.09,59.09 104.62,59.09
Outline: 104.62,59.09 104.6,59.09
Outline: 132.09,68.21 134.07,68.21 134.07,75.31
Outline: 134.07,75.32 104.6,75.32
Outline: 104.6,75.32 104.58,75.32
Outline: 68.08,1.99 arc333 66.08,1.99
Outline: 66.08,1.98 66.08,0 58.97,0 58.97,29.49
Outline: 68.09,2 68.09,0.02 75.19,0.02
Outline: 75.2,0.02 75.2,29.51
Outline: 1.98,67.79 0,67.79 0,74.9 29.49,74.9
Outline: 2,65.78 0.02,65.78 0.02,58.68
Outline: 0.02,58.67 29.51,58.67
Outline: 75.09,104.48 75.44,104.48 arc-90 104.6,75.32
Outline: 104.62,59.09 104.62,58.93 arc-90 75.19,29.5
Outline: 58.98,29.49 58.67,29.49 arc-90 29.5,58.66
Outline: 29.49,74.89 29.49,75.1 arc-90 58.87,104.48
Outline: 1.99,65.79 arc333 1.99,67.79 arc-333 1.99,65.79
Copper layers (1*2*15*16): Top 0.035559375mm / dielectric 1.501140625mm / Route2 0.035559375mm / dielectric 0.149859375mm / Route15 0.035559375mm / dielectric 0.200659375mm / Bottom 0.035559375mm
Design rules "HKN-4pcb-66board": minimum track width 6mil, minimum drill 15mil, track to track 6mil, track to pad 6mil, pad to pad 6mil, via to via 6mil, smd to smd 6mil, copper to edge 10mil, drill to drill 10mil, minimum pad ring 10mil, minimum via ring 8mil, stop-mask expansion 4mil, vias tented up to drill 0mil, thermal gap 10mil
tKeepout: area 41.6,37.6 to 49.4,51.8
bKeepout: area 41.7,37.6 to 49.5,51.8
tRestrict: area 65.1,65.6 to 68.1,68.4
bRestrict: area 65.1,65.6 to 68.1,68.4

### Footprints (pad centres in the part's own frame; a part is rotated, then mirrored left to right if it is on the bottom)
BALUN = smd 0.35 x 0.8: 1 -0.65,-0.8; 2 0,-0.8; 3 0.65,-0.8; 4 0.65,0.8; 5 0,0.8; 6 -0.65,0.8
BATTERY-W/HOLDER-380MAH-HUBSAN = drill 1 long: + -2.54,14.605; - 0,14.605 | hole 1.4: -7.35,-12.05; -7.35,12.05; 7.35,-12.05; 7.35,12.05
HDRV10W63P254_10X1_2540X254H838_HS = drill 1.1 pad 1.65 square: 1 0,0 | drill 1.1 pad 1.65: 2 2.54,0; 3 5.08,0; 4 7.62,0; 5 10.16,0; 6 12.7,0; 7 15.24,0; 8 17.78,0; 9 20.32,0; 10 22.86,0
CAPC2012X140_HS = smd 1.08 x 1.42: 1 -0.895,0; 2 0.895,0
CAPMP7343X310_HS = smd 2.37 x 2.43: 1 -3.12,0; 2 3.12,0
SOD3716X135_HS = smd 2.2 x 1.2: A 1.9,0; C -1.9,0
LEDSC125X200X120-2_HS = smd 0.94 x 0.99: A 1.045,0; C -1.045,0
2X3-NS = drill 1.016 pad 1.88 square: 1 -2.54,-1.27 | drill 1.016 pad 1.88 octagon: 2 -2.54,1.27; 3 0,-1.27; 4 0,1.27; 5 2.54,-1.27; 6 2.54,1.27
MALE_HEADER_2X1_0.1IN = drill 1.1 pad 1.65 square: 1 0,0 | drill 1.1 pad 1.65: 2 2.54,0
SOT23 = smd 1 x 1.4: 1 -0.95,-1.1; 2 0.95,-1.1; 3 0,1.1
RESC2012X60_HS = smd 0.92 x 1.38: 1 -0.955,0; 2 0.955,0
FTDI_BASIC = drill 1.016 pad 1.88: CTS 10.16,0; DTR 0,0; GND 12.7,0; RXI 2.54,0; TXO 5.08,0; VCC 7.62,0
TE_FSM8JSMA_HS = smd 1.4 x 2.1: 1 -2.25,4.55; 2 -2.25,-4.55; 3 2.25,4.55; 4 2.25,-4.55
QFN-64 = smd 1.562 x 0.28: 1 -4.881,3.75; 2 -4.881,3.25; 3 -4.881,2.75; 4 -4.881,2.25; 5 -4.881,1.75; 6 -4.881,1.25; 7 -4.881,0.75; 8 -4.881,0.25; 9 -4.881,-0.25; 10 -4.881,-0.75; 11 -4.881,-1.25; 12 -4.881,-1.75; 13 -4.881,-2.25; 14 -4.881,-2.75; 15 -4.881,-3.25; 16 -4.881,-3.75; 33 4.881,-3.75; 34 4.881,-3.25; 35 4.881,-2.75; 36 4.881,-2.25; 37 4.881,-1.75; 38 4.881,-1.25; 39 4.881,-0.75; 40 4.881,-0.25; 41 4.881,0.25; 42 4.881,0.75; 43 4.881,1.25; 44 4.881,1.75; 45 4.881,2.25; 46 4.881,2.75; 47 4.881,3.25; 48 4.881,3.75 | smd 0.28 x 1.562: 17 -3.75,-4.881; 18 -3.25,-4.881; 19 -2.75,-4.881; 20 -2.25,-4.881; 21 -1.75,-4.881; 22 -1.25,-4.881; 23 -0.75,-4.881; 24 -0.25,-4.881; 25 0.25,-4.881; 26 0.75,-4.881; 27 1.25,-4.881; 28 1.75,-4.881; 29 2.25,-4.881; 30 2.75,-4.881; 31 3.25,-4.881; 32 3.75,-4.881; 49 3.75,4.881; 50 3.25,4.881; 51 2.75,4.881; 52 2.25,4.881; 53 1.75,4.881; 54 1.25,4.881; 55 0.75,4.881; 56 0.25,4.881; 57 -0.25,4.881; 58 -0.75,4.881; 59 -1.25,4.881; 60 -1.75,4.881; 61 -2.25,4.881; 62 -2.75,4.881; 63 -3.25,4.881; 64 -3.75,4.881 | smd 7.15 x 7.15: 65 0,0
MOTOR_PADS = smd 2 x 2: V+ -1,0; V- 2,0
ANTENNA-CHIP5 = smd 1.016 x 2.54: FEED -3.302,0; NC 3.302,0
LGA-24/4MM = smd 0.35 x 0.85: 1 -1.25,1.975; 8 -1.25,-1.975; 9 -0.75,-1.975; 10 -0.25,-1.975; 11 0.25,-1.975; 12 0.75,-1.975; 13 1.25,-1.975; 20 1.25,1.975; 21 0.75,1.975; 22 0.25,1.975; 23 -0.25,1.975; 24 -0.75,1.975 | smd 0.8 x 0.35: 2 -2,1.25; 3 -2,0.75; 4 -2,0.25; 5 -2,-0.25; 6 -2,-0.75; 7 -2,-1.25; 14 2,-1.25; 15 2,-0.75; 16 2,-0.25; 17 2,0.25; 18\ 2,0.75; 19 2,1.25
WIRE_BRIGE = smd 1.27 x 0.635: BATT_GND 0,0; GND -1.27,0
SOT23-DBV = smd 0.55 x 1.2: 1 -0.95,-1.3; 2 0,-1.3; 3 0.95,-1.3; 4 0.95,1.3; 5 -0.95,1.3
CRYSTAL-SMD-5X3 = smd 1.9 x 1.1: 1 -1.85,-1.15; 2 1.85,-1.15; 3 1.85,1.15; 4 -1.85,1.15

### Placement (x,y rotation side)
B2  45.81,44.76 0 top
BATT1  69.15,68.67 0 bottom
BREAKOUT_HEADER  38.5,52.98 90 top
C1  57.85,56 0 top
C2  54.45,55.97 180 top
C3  73.79,102.19 0 top
C4  82.54,99.43 270 top
C5  75.7,91.15 0 top
C6  65.11,32.64 0 top
C7  21.97,72.36 0 top
C8  62.11,23.28 90 top
C9  44.43,41.56 270 top
C10  98.41,71.57 90 top
C11  51.53,54.26 270 top
C12  51.99,87.49 180 top
C13  35.2,61.75 270 top
C14  68.3,102.15 0 top
C15  51.37,35.18 90 top
C16  51.79,96.99 180 top
C17  71.54,69.65 180 top
C18  69.76,95.29 90 top
C19  74.49,68.63 270 top
C20  67.45,62.5 90 top
C21  65.18,62.48 270 top
C22  46.49,41.65 90 top
C23  61.86,31.12 270 top
C24  113.81,61.64 180 top
C25  72.51,114.04 270 top
D1  17.09,67.19 90 top
D2  67.11,117.28 0 top
D3  117.09,67.19 270 top
D4  67.09,17.19 180 top
D5  57.79,101.89 0 top
D7  56.69,97.19 270 top
D8  47.81,97.15 270 top
D9  61.56,98.56 0 top
J1  99.37,56.84 80 top
J2  61.4,87.99 0 top
J7  71.44,98.96 0 top
M1  29.13,68.88 270 top
M2  67.09,105.19 0 top
M3  105.09,67.19 90 top
M4  67.09,29.19 0 top
MOSFET1  20.65,67.2 90 top
MOSFET2  67.09,113.19 0 top
MOSFET3  113.09,67.19 270 top
MOSFET4  67.09,21.19 180 top
R1  44.44,84.45 0 top
R2  57.65,35.06 270 top
R3  56.69,92.19 270 top
R4  47.79,92.09 270 top
R5  49.33,58.13 90 top
R6  51.82,58.08 270 top
R7  62.99,101.89 0 top
R8  55.7,35.09 270 top
R9  61.69,96.09 0 top
R11  25.59,69.09 270 top
R12  35.09,67.19 270 top
R13  69.09,108.69 180 top
R14  67.09,99.19 180 top
R15  108.09,65.19 90 top
R16  98.39,66.89 90 top
R17  69.09,26.19 180 top
R18  67.09,35.19 180 top
RX_LED  87.84,96.67 270 top
RX_R  82.91,95.82 180 top
SERIAL_DEBUGGER  89.46,40.48 45 top
SERIAL_PROGRAMMER  73.21,31.53 25 top
SWRESET  38.13,84.21 0 top
TX_LED  77.02,97.15 270 top
TX_R  83.19,92.59 0 top
U2  55.61,44.67 0 top
U$1  13.06,67.12 90 top
U$2  67.09,121.19 0 top
U$3  121.09,67.19 270 top
U$4  67.09,13.19 180 top
U$5  38.18,44.72 180 top
U$6  66.59,66.99 180 top
U$7  62.09,83.83 180 top
U$9  66.21,91.9 180 top
Y2  55.86,53.06 180 top

### Tracks (layer width: path | path; a pad name or v marks a point on that pad's centre or on a via)
3V  (via drill 0.35)
  Top 0.152: U$6.23 U$6.22 v66.31,64.11 | U$6.7 68.56,68.24 U$6.8 67.74,69.06 67.74,69.48 67.61,69.62 65.57,69.62 65.49,69.53 65.44,69.48 65.44,69.06 U$6.13 | U$6.3 71.77,66.24 71.79,66.22 72.86,66.22 v72.89,66.19 | J7.1 72.9,100.41 C3.1 72.79,102.29 72.79,103.93 73.38,104.52 73.53,104.52 73.54,104.53 74.26,104.53 | C4.1 81.9,102.07 80.54,103.43 75.36,103.43 74.26,104.53 | 74.26,104.53 74.22,104.57 | U$9.5 67.16,89.59 67.51,89.24 74.87,89.24 75.95,90.32 75.95,93.29 74.42,94.82 73.03,94.82 v72.88,94.67 | v73.69,96.67 73.69,96.71 J7.1 | v52.26,93.58 52.34,93.5 52.69,93.84 C16.1 52.69,97.98 53.01,98.31 53.16,98.31 v53.25,98.22 | v45.63,92.95 45.63,87.55 45.4,87.32 R1.2 47.01,82.83 v47.01,81.59 | R7.2 64.14,101.89 65.24,100.79 v65.58,100.79 | v71.09,100.91 71.09,99.31 J7.1 | R2.2 59.29,33.73 R8.2 58.25,32.39 58.22,32.36 58.22,32.09 v58.19,32.06 | BREAKOUT_HEADER.7 40.49,68.22 41.5,67.21 41.5,67.59 v41.41,67.68 | U2.34 64.09,41.42 64.1,41.43 64.3,41.43 v64.36,41.37 | U2.44 64.19,46.42 64.21,46.4 64.64,46.4 v64.68,46.36 | U$6.1 67.84,64.49 68.06,64.27 68.4,64.27 68.65,64.02 68.94,64.02 v69.02,64.1 | U2.23 54.86,38.74 54.92,38.68 54.92,38.05 v54.98,38.13 | U2.59 54.36,50.81 v54.41,50.8 | U2.54 56.86,50.75 v56.88,50.77 | U2.62 52.86,50.33 51.69,51.5 51.69,51.94 v51.67,51.96 | U$6.7 U$6.6 U$6.5 71.64,67.24 v72.12,67.72 74.48,67.72 C19.2 | C17.2 70,69.65 U$6.7
  Route2 0.152: 72.27,67.22 73.47,68.42 | v72.89,66.19 73.08,66.19 73.1,66.21 75.91,66.21 75.97,66.15 | v66.31,64.11 67.89,63.95 69.2,62.64 | v41.41,67.68 42.94,67.68 44.07,66.55 | v47.01,81.59 47.01,79.93 45.71,78.63 | v64.36,41.37 65.79,41.37 65.84,41.42 | 63.63,39.88 65.2,38.31 65.2,36.79 62.6,34.19 62.6,33.87 60.79,32.06 v58.19,32.06 54.93,35.32 v54.98,38.13 | 56.73,52.12 56.68,52.17 | v64.68,46.36 66.06,46.36 66.35,46.65 | v69.02,64.1 69.12,64.1 69.94,63.28 | v53.25,98.22 54.91,98.22 55.06,98.07 55.06,99.05 56.22,100.21 63.12,100.21 63.46,99.87 64.52,99.87 65.44,100.79 v65.58,100.79 | v56.88,50.77 55.77,50.77 55.49,51.05 55.3,50.86 v54.41,50.8 53.31,51.96 v51.67,51.96
  Bottom 0.152: v72.88,94.67 72.88,95.7 73.84,96.66 v73.7,96.66 v73.69,96.67 | v52.26,93.58 46.28,93.58 45.75,93.05 45.73,93.05 v45.63,92.95 | v71.09,100.91 70.97,100.79 v65.58,100.79
  pour Route2: 54.49,88.79 40.19,88.79 40.19,58.29 40.29,58.29 50.61,50.03 50.59,39.49 66.69,39.49 77.49,50.29 77.49,87.89 71.49,87.89 71.49,63.69 54.59,63.69 54.59,87.19 54.99,87.19
AVDD
  Top 0.152: U2.60 53.8,49.61 53.8,51.08 53.75,51.13 52.97,51.13 52.96,51.14 52.92,51.14 52.83,51.23 52.83,52.55 52.84,52.56 52.84,53.06 52.83,53.07 52.83,54.9 52.58,55.16 C11.1
BAT_GND  (via drill 0.35)
  Top 0.152: C6.2 66.01,30.27 M4.1 70.05,26.23 R17.1 69.54,25.68 v69.54,24.56 | MOSFET4.2 66.14,23.42 66.58,23.86 66.67,23.86 v66.88,24.07 64.55,26.4 C8.2 | MOSFET1.2 23.7,68.15 R11.1 | R11.1 25.59,69.84 M1.1 | D8.C 47.81,98.62 48.38,99.19 55.73,99.19 D7.C 57.02,98.56 D9.C | M2.1 69.2,103.09 C14.2 69.2,96.75 C18.2 | M2.1 67.09,105.73 R13.1 70.05,110.09 69.21,110.92 | C18.2 69.95,96 75.11,96 78.82,92.29 C5.2 94.9,75.07 v94.9,73.95 | 67.79,96.15 67.36,96.15 66.21,95 U$9.2 | 67.79,96.15 69.73,96.15 C18.2 | BATT1.- 63.92,83.28 U$7.GND 63.5,83.83 63.51,83.84 | D8.C 47.57,98.19 32.57,83.2 32.57,72.32 M1.1 | D8.C 49.28,98.19 54.43,103.35 | 54.43,103.35 54.52,103.44 | 54.43,103.35 59.04,103.35 60.32,104.63 60.32,104.7 v60.4,104.78 | v63.53,105.11 67.01,105.11 M2.1 | MOSFET3.2 110.09,66.24 R15.1 108.05,64.23 | 108.05,64.23 M3.1 104.12,68.16 102.73,68.16 102.43,68.46 102.43,70.7 100.67,72.47 C10.2 97.23,72.47 96.83,72.06 96.74,72.06 v96.67,71.99 | C13.2 33.07,60.85 32.63,61.29 32.63,61.53 | 32.63,61.53 v32.54,61.62 | v32.37,67.99 30.02,67.99 M1.1 | 32.36,61.26 32.63,61.53 | 67.79,96.15 67.79,96.55 67.44,96.9 66.07,96.9 65.69,96.52 65.69,96.38 v65.53,96.22 | C7.2 R11.1 | C25.2 69.21,110.92 | 69.21,110.92 MOSFET2.2 | C24.2 110.64,61.64 108.05,64.23
  Route2 0.152: BREAKOUT_HEADER.9 33.55,73.3 M1.1
  Route15 0.152: v96.67,71.99 96.67,72.18 v94.9,73.95 | M3.1 103.86,61.83 103.89,61.27 103.66,59.89 103.58,59.49 103.29,58.28 102.89,56.79 101.77,51.96 100.98,49.65 96,41.64 92.98,38.79 91.99,37.76 87.5,34.65 83.64,33.65 82.19,33.05 79.69,32.06 77.74,31.56 75.2,30.75 73.64,30.15 72.54,29.59 71,28.45 70.1,27.72 69.23,27.7 68.63,27.97 68.26,28.03 67.88,28.4 M4.1
  Bottom 0.152: v66.88,24.07 69.03,24.07 69.44,24.48 69.46,24.48 v69.54,24.56 | v60.4,104.78 62.8,104.78 63,104.98 63.4,104.98 v63.53,105.11 | v32.54,61.62 32.54,67.49 32.43,67.6 32.43,67.93 v32.37,67.99 | v65.53,96.22 66.12,96.22 68.93,93.41 68.93,83.5 BATT1.-
  pour Route15: 37.43,39.23 40.4,40.56 41.6,36.25 45.4,34.67 55.58,30.62 64.37,29.61 66.96,28.09 71.71,27.71 74.49,30.05 79.61,31.64 84.86,33.34 88.4,34.23 92.51,37.27 97.44,42.52 101.75,49.41 104.27,60.17 105.6,67.25 103.77,68.01 101.81,63.84 81.76,63.84 81.38,79.34 88.15,86.8 91.34,91.62 89.97,98.1 88.65,99.94 85.07,101.21 77.83,102.92 75.7,103.76 74.61,103.94 71.52,104.61 69.83,105.51 67.88,105.14 67.3,104.51 61.87,104.4 57.55,103.4 52.39,102.66 40.27,95.65 35.42,91.59 30.15,69.4 31.1,60.65 35.81,48.15 -18.36,46 -18.34,116.21 50.49,167.41 110.08,162.23 172.38,131.73 198.5,88.16 198.77,40.77 119.03,-39.63 22.05,5.83 26.86,25.85 37.68,38.97
DTR
  Top 0.152: SERIAL_PROGRAMMER.DTR 73.21,31.87 68.69,36.39 65.68,36.39 59.17,29.88 59.15,29.9 56.92,30.09 C15.1
DVDD
  Top 0.152: 53.96,36.14 54.36,36.55 U2.22 U2.21 53.86,36.24 53.96,36.14 | 53.96,36.14 C23.1
GND  (via drill 0.35)
  Top 0.152: C3.2 74.69,99.66 74.39,99.37 | 74.39,99.37 J7.2 | RX_LED.C 87.2,98.36 C4.2 77.36,98.53 TX_LED.C 75.56,98.19 74.39,99.37 | C12.2 51.1,88.91 51.41,89.22 51.4,89.22 v51.33,89.29 | C16.2 50.9,95.7 50.73,95.54 50.73,95.08 v50.67,95.02 | SWRESET.1 35.88,89.93 37.09,91.14 37.09,91.19 v37.41,91.25 | v35.86,76.34 35.86,79.64 SWRESET.2 | U$6.14 U$6.15 U$6.16 U$6.17 U$6.18\ U$6.19 64.56,65.71 | C23.2 53.78,33.97 55.04,32.71 55.57,32.71 v55.76,32.52 | 60.47,41.9 U2.35 60.43,41.98 59.41,41.98 | v67.29,46.44 67.07,46.44 66.3,47.21 63.81,47.21 63.51,46.92 U2.45 60.44,46.87 59.41,46.87 | C20.1 67.43,61.58 C21.2 65.06,61.71 60.21,61.71 60.16,61.66 | U$6.20 64.7,65.02 64.56,65.15 64.56,65.71 | D5.C 55.13,101.89 v54.98,101.74 | C17.1 75.08,69.65 75.24,69.49 74.53,69.49 C19.1 75.09,69.52 v75.94,68.67 | C9.2 46.41,40.67 C22.1 48.43,40.42 49.2,41.19 49.2,42.98 49.62,43.4 50.71,43.4 U2.11 51.77,43.42 51.81,43.38 | v48.37,46.8 49.75,45.42 U2.7 51.79,45.42 51.81,45.44 | 53.92,55.97 C2.2 53.62,56.03 53.62,58.29 52.88,59.03 R6.1 51.82,62.1 v51.07,62.85 | 58.38,56 57.44,56.94 54.89,56.94 53.92,55.97 | U$7.BATT_GND 60.74,83.83 60.72,83.81 59.98,83.81 v59.66,83.49 | 59.41,41 59.28,40.87 55.39,40.87 | 59.41,41 59.41,41.98 | 59.41,41.98 59.41,46.87 | 59.41,46.87 59.41,48.34 59.28,48.47 56.37,48.47 | 56.37,48.47 54.88,48.47 | 54.88,48.47 53.23,48.47 | 51.81,43.87 51.81,45.44 | 51.81,43.87 51.81,43.38 | 51.81,45.44 51.81,48.34 51.95,48.48 53.36,48.48 U2.61 53.23,49.68 53.23,50.43 53.1,50.56 53.06,50.56 52.28,51.34 52.28,52.21 51.53,52.96 C11.2 51.05,53.36 49.95,54.46 49.95,56.09 50.12,56.26 53.63,56.26 53.92,55.97
  Top 0.152: 51.81,43.38 51.81,41 51.94,40.87 53.25,40.87 | 54.88,48.47 54.88,49.53 U2.58 | 56.37,48.47 U2.55 | U2.33 59.49,40.92 59.41,41 | 55.39,40.87 53.25,40.87 | U2.24 55.36,40.84 55.39,40.87 | U2.20 53.36,40.76 53.25,40.87 | U2.10 51.76,43.92 51.81,43.87 | C1.2 58.75,60.24 60.16,61.66 | 60.16,61.66 60.16,64.55 61.37,65.77 | 61.37,65.77 64.5,65.77 64.56,65.71 | 61.37,65.77 57.9,65.77 v57.85,65.72
  Route2 0.152: BREAKOUT_HEADER.10 36.36,75.84 v35.86,76.34
  Route15 0.152: v51.33,89.29 51.33,91.24 51.58,91.49 | v50.67,95.02 50.67,93.19 50.22,92.74 | v54.98,101.74 52.58,101.8 52.28,101.5 | v37.41,91.25 37.24,91.58 38.95,93.29 | 68,45.56 67.29,46.27 v67.29,46.44 66.76,45.91 66.76,41.77 60.75,35.76 60.75,34.61 58.81,32.67 57.94,32.67 57.79,32.52 v55.76,32.52 57.08,32.52 57.1,32.54 | v59.66,83.49 59.66,81.92 59.2,81.46 | v51.07,62.85 51.07,63.08 49.99,64.16 | v57.85,65.72 57.85,65.01 58.45,64.41
  other vias: 43.55,50.43 45.25,50.77 47.37,50.69 48.37,49.61 48.43,48.29 42.88,49.14 42.73,47.8 42.48,42.25 48.54,41.93 48.54,39.53 48.55,45.77 42.5,40.47 42.38,38.63 43.79,38.57 45.52,38.25 47.51,38.38 48.48,43.77
  pour Route15: 47.46,46.7 arc-90 47.49,46.67 47.49,43.13 arc-90 47.33,42.97 44.09,42.97 arc-90 44.07,42.99 44.07,46.62 arc-90
  pour Route15: 46.93,53.7 50.32,49.71 49.73,46.36 49.72,42.84 49.55,37.11 41.72,36.8 54.12,31.65 63.26,30.28 69.19,30.01 74.21,30.83 88.28,35.81 99.7,47.78 102.8,59.44 102.89,62.63 79.84,62.45 79.57,78.58 80.12,81.77 88.59,89.24 89.79,96.85 89.59,96.99 87.68,99.91 81.39,101.64 77.29,102.73 75.74,103.46 68.37,104.1 64.9,104.1 52.68,101.92 40.39,94.76 37.3,92.07 31.66,62.63 35.39,54.89 36.14,49.78
  pour Route15: 44.44,46.25 47.1,46.29 47.12,43.2 44.47,43.22
  pour Bottom: 42.47,46.53 arc-90 41.75,47.25 arc-90 41.71,47.29 41.71,50.46 arc-90 43.1,51.85 43.62,51.85 arc-90 43.64,51.87 46.51,51.87 arc-90 49.26,49.12 49.26,48.34 arc-90 49.34,48.26 49.34,39.26 arc-90 47.73,37.65 45.35,37.65 arc90 45.33,37.67 42.13,37.67 arc-90 41.73,38.07 41.73,39 arc90 41.75,39.02 41.75,42.61 arc90 43.14,44 43.14,45.71 43.14,46.25 arc90 42.78,46.61 42.47,46.61
  pour Route2: 42.56,46.62 41.84,46.62 arc-90 41.72,46.74 41.72,50.55 arc-90 42.92,51.75 43.36,51.75 arc90 43.42,51.69 47.14,51.69 arc-90 49.27,49.56 49.27,48.72 arc90 49.26,48.71 49.26,38.82 arc-90 47.97,37.53 47.56,37.53 arc-90 47.47,37.44 42.96,37.44 arc-90 41.62,38.78 41.62,42.74 arc90 43.08,44.2 43.08,45.26 43.08,46.63 arc90 43.07,46.64 42.57,46.64
  pour Top: 43.12,46.19 arc90 42.66,46.65 42.01,46.65 arc-90 41.79,46.87 41.79,50.53 arc-90 42.95,51.69 45.31,51.69 arc90 45.33,51.67 46.99,51.67 arc-90 49.28,49.38 49.28,47.77 arc-90 49.32,47.73 49.32,39.24 arc-90 47.73,37.65 45.81,37.65 arc-90 45.75,37.59 42.82,37.59 arc-90 41.69,38.72 41.69,39.38 arc90 41.73,39.42 41.73,42.59 arc90 43.18,44.04 43.18,45.28 arc-90 43.04,45.42
MISO  (via drill 0.35)
  Top 0.152: U2.39 65.11,43.92 65.22,43.81 65.22,43.83 v65.32,43.93
  Bottom 0.152: J1.1 100.18,53.24 98.24,51.3 97.11,51.3 89.74,43.93 v65.32,43.93
MOSI  (via drill 0.35)
  Top 0.152: U2.38 64.97,43.42 65.07,43.32 65.57,43.32 65.58,43.33 68.76,43.33 v68.92,43.17 | v88.27,43.04 88.27,43.29 96.15,51.17 96.15,55.09 J1.4
  Bottom 0.152: v68.92,43.17 74.9,43.17 74.92,43.19 88.12,43.19 v88.27,43.04
N$2
  Top 0.152: R11.2 24.11,68.13 23.82,67.84 23.35,67.84 MOSFET1.1 | 26.41,67.31 R11.2 | R12.2 35.2,66.12 C13.1 30.88,62.64 29.24,64.28 27.09,64.28 25.81,65.56 25.81,67.91 R11.2
N$3
  Top 0.152: U2.57 55.36,51.91 | Y2.3 54.21,51.81 54.31,51.91 55.36,51.91 | C2.1 55.35,52.94 55.36,52.93 55.36,51.91
N$4
  Top 0.152: U2.56 55.86,54.18 55.89,54.21 57.13,54.21 | 57.13,54.21 Y2.1 | C1.1 56.96,54.38 57.13,54.21
N$7
  Top 0.152: B2.2 45.73,43.88 45.76,43.85 C22.2
N$9
  Top 0.152: D9.A 62.61,97.96 R9.1
N$14
  Top 0.152: 16.5,69.09 D1.A
  Top 0.762: U$1.V- 16.47,69.12 16.5,69.09 | D1.A 17.66,69.09 MOSFET1.3
N$17
  Top 0.152: BATT1.+ 71.69,87.45 71.05,88.09 70.97,88.17 64.12,88.17 J2.2
N$18
  Top 0.152: D5.A R7.1
N$19
  Top 0.152: 68.23,120.33 U$2.V-
  Top 0.762: U$2.V- 69.09,117.36 D2.A 69.01,116.21 MOSFET2.3
N$21
  Top 0.152: TX_R.1 82.23,93.1 80.15,95.19 77.94,95.19 TX_LED.A
N$22
  Top 0.152: RX_LED.A 84.06,95.62 RX_R.1
N$23
  Top 0.152: C20.2 67.37,64.98 U$6.24
N$24
  Top 0.152: 117.19,65.19 D3.A
  Top 0.762: U$3.V- 117.19,65.19 D3.A 116.09,65.29 MOSFET3.3
N$26  (via drill 0.35)
  Top 0.152: U$9.4 59.46,90.6 58.98,90.12 58.32,90.12 v58.2,90 | v54.31,89.43 54.31,88.91 C12.1
  Bottom 0.152: v58.2,90 55.06,90 54.52,89.46 54.34,89.46 v54.31,89.43
N$27
  Top 0.152: R4.1 47.79,96.08 D8.A
N$28
  Top 0.152: D7.A R3.1
N$29
  Top 0.152: 65.09,17.09 D4.A
  Top 0.762: U$4.V- 65.09,17.09 | D4.A 65.19,18.19 MOSFET4.3
N$33
  Top 0.152: U$6.21 65.74,64.92 65.74,64.5 65.25,64 C21.1
N$38  (via drill 0.35)
  other vias: 41.41,47.02
N$48
  Top 0.152: R14.2 67.41,100.46 C14.1 66.12,102.15 64.93,103.34 62.29,103.34 61.88,103.75 61.88,107.51 62.36,107.99 67.44,107.99 R13.2 68.14,110.09 MOSFET2.1
N$50
  Top 0.152: MOSFET3.1 110.09,68.14 R15.2 108.09,72.28 106.51,73.86 97.09,73.86 95.23,72 95.23,71.13 96.22,70.14 98.15,70.14 98.41,70.4 | 98.41,70.4 C10.1 | 98.41,70.4 98.41,67.86 R16.2
N$52
  Top 0.152: MOSFET4.1 68.04,26.09 R17.2 66.47,26.19 64.35,28.31 64.35,32.5 C6.1 64.22,33.27 R18.2
PD5
  Top 0.152: 58.36,39.15 U2.30
PWM1  (via drill 0.35)
  Top 0.152: M1.2 33.29,66.34 R12.1 | v71.15,45.04 63.01,45.04 U2.41 | R12.1 35.09,69.36 v34.23,70.22 | R12.1 36.03,68.14 BREAKOUT_HEADER.6 38.5,64.63 37.44,63.58 37.44,62.7 37.67,62.48
  Bottom 0.152: v34.23,70.22 47.97,68.03 71.08,44.92 71.08,44.97 v71.15,45.04
PWM2  (via drill 0.35)
  Top 0.152: 38.43,63.19 38.48,63.14 BREAKOUT_HEADER.5 38.68,63.14 38.74,63.2 | R14.1 68.05,97.91 67.99,97.86 v67.99,97.6 v68,97.59 | U2.51 58.36,50.32 58.84,50.8 58.93,50.8 59,50.86 61.45,50.86 61.73,51.15 63.98,51.15 64.01,51.18 v63.97,51.19
  Route15 0.152: BREAKOUT_HEADER.5 36.18,63.14 33.49,65.83 33.49,68.69 31.82,70.89 33.23,79.76 34.56,85.32 36.15,90.94 39.71,94.68 41.36,95.53 47.36,98.85 51.14,100.79 52.45,102.1 53.85,102.1 56.69,102.7 64.87,103.75 65.02,103.9 68.34,103.9 M2.2 70.59,104.23 70.59,103.26 70.58,103.25 70.58,102.06 69.77,101.25 69.77,100.93 69.69,100.85 69.69,98.24 69.04,97.59 v68,97.59
  Bottom 0.152: BREAKOUT_HEADER.5 46.78,63.14 48.88,61.04 49.14,61.04 49.16,61.02 54.43,61.02 63.57,51.88 63.57,51.73 v63.97,51.19
PWM3  (via drill 0.35)
  Top 0.152: M3.2 105.09,72.59 104.42,73.26 102.85,73.26 v102.39,72.8 | v100.76,69.82 100.76,67.15 100.19,66.58 99.03,66.58 R16.1 88.45,55.99 88.45,52.52 85.48,49.55 v64.79,49.55 61.42,49.55 | U2.49 61.42,49.55 | 61.42,49.55 61.45,49.52
  Bottom 0.152: v102.39,72.8 102.39,71.45 v100.76,69.82 100.69,69.75 | BREAKOUT_HEADER.4 53.65,60.6 64.01,50.24 64.06,50.17 v64.79,49.55
PWM4  (via drill 0.35)
  Top 0.152: M4.2 69.63,33.6 R18.1 | U2.50 58.86,50.3 59.12,50.56 61.25,50.56 | 61.25,50.56 61.32,50.56 | 61.25,50.56 68.3,50.56 v68.45,50.41
  Route15 0.152: M4.2 68.95,29.87 68.95,40.6 68.31,41.23 68.31,43.42 68.71,43.82 68.71,50.15 v68.45,50.41 65.41,53.45 47.4,53.45 42.79,58.06 BREAKOUT_HEADER.3
RESET  (via drill 0.35)
  Top 0.152: SWRESET.3 43.27,84.23 | 43.27,84.23 R1.1 43.56,84.38 43.56,80.35 42.87,79.66 SWRESET.4 41.34,74.51 v43.48,74.51 | 43.2,84.16 43.27,84.23 | 100.88,58.93 J1.5 101.06,61.32 101.18,61.44 100.83,61.44 v100.38,61.89 | v52.82,38.45 52.71,38.78 52.71,38.55 51.59,37.43 C15.2 49.71,37.73 49.71,42.77 49.86,42.92 U2.12
  Route15 0.152: v100.38,61.89 54.92,61.89 54.25,62.56 | 54.25,62.56 43.53,73.28 43.53,74.46 v43.48,74.51 | v54.6,58.56 53.62,61.93 54.25,62.56
  Bottom 0.152: v52.82,38.45 52.82,39.9 52.84,57.18 52.84,57.26 54.14,58.56 v54.6,58.56
RFANT
  Top 0.152: 44.05,42.84 C9.1
  Top 0.457: U$5.FEED 41.9,45.14 43.09,43.95 44.24,43.95 | 44.24,43.95 B2.1 | C9.1 44.43,43.76 44.24,43.95
RFN
  Top 0.152: B2.3 47.37,43.95 47.89,44.48 50.67,44.48 U2.9
RFP
  Top 0.152: B2.4 47.34,45.55 47.91,44.99 50.66,44.99 U2.8
RX0  (via drill 0.35)
  Top 0.152: RX_R.2 81.95,94.48 81.95,94.47 82.13,94.29 85.12,94.29 85.61,93.8 85.61,88.54 v85.7,88.45 | SERIAL_PROGRAMMER.TXO 77.81,33.63 77.36,33.18 | SERIAL_PROGRAMMER.TXO 77.81,35.32 72.93,40.2 72.93,45.89 71.3,47.52 62.99,47.52 U2.46 | SERIAL_PROGRAMMER.TXO 77.81,32.92 79.15,31.58 83.6,31.58 88.9,36.88 88.9,37.64 86.58,39.96 81.11,39.96 80.72,40.35 80.72,41.5 85.76,46.54 85.76,46.77 v85.61,46.92
  Bottom 0.152: v85.7,88.45 85.7,48.31 85.61,48.22 v85.61,46.92
RX1  (via drill 0.35)
  Top 0.152: 66.46,38.23 66.47,38.24 66.47,38.27 | 66.47,38.27 v66.59,38.39 | U2.27 56.86,38.52 57.05,38.33 66.41,38.33 66.47,38.27
  Bottom 0.152: SERIAL_DEBUGGER.TXO 93.09,44.07 95.77,41.39 95.77,41.04 93.12,38.39 v66.59,38.39
SCK  (via drill 0.35)
  Top 0.152: U2.37 67.71,42.92 68.08,42.55 68.08,42.17 68.8,41.45 70.76,41.45 v70.79,41.42 | v85.05,41.49 85.82,41.49 95.64,51.31 95.64,59 99.89,63.25 100.78,63.25 103.15,60.88 103.15,59.15 J1.3
  Bottom 0.152: v70.79,41.42 85.05,41.42 85.07,41.44 85.07,41.47 v85.05,41.49
SCL  (via drill 0.35)
  Top 0.152: BREAKOUT_HEADER.1 43.8,52.98 | 43.8,52.98 48.26,52.98 49.97,50.8 49.97,50.48 v49.95,50.46 | U$6.2 71.23,65.74 72.41,64.56 74.61,64.56 77.31,65.51 77.31,69.39 75.23,71.15 74.42,71.56 55.16,71.56 43.8,60.2 v43.8,58.99 | 43.8,52.98 43.8,53.93 43.77,53.96 v43.77,54.53 | U2.25 55.86,36.2 R8.1 56.02,36.05 v56.83,36.94
  Bottom 0.152: v49.95,50.46 49.95,39.24 52.27,36.92 v56.83,36.94 | v43.77,54.53 43.77,57.4 43.71,57.46 43.71,58.9 v43.8,58.99
SDA  (via drill 0.35)
  Top 0.152: 46.61,55.52 47,55.52 49.71,52.17 v49.91,52.17 | 46.61,55.52 BREAKOUT_HEADER.2 | U$6.4 72.58,66.74 72.64,66.8 75.7,66.8 76.9,68 76.9,69.14 75.62,70.42 75.15,70.82 72.68,70.82 72.65,70.79 | 72.65,70.79 73.19,70.79 | 72.65,70.79 55.45,70.79 55.43,70.81 55.19,70.81 46.7,62.32 46.7,55.61 46.61,55.52 | v59.06,36.95 58.12,36.02 R2.1 57.68,36.05 57.68,37.79 57.44,38.03 56.8,38.03 56.36,38.47 U2.26
  Bottom 0.152: v49.91,52.17 50.33,51.75 50.4,51.52 50.77,50.8 50.77,50.3 50.48,50.01 50.48,39.35 52.3,37.53 58.23,37.54 58.47,37.54 v59.06,36.95
TX0  (via drill 0.35)
  Top 0.152: TX_R.2 84.15,90.16 84.03,90.05 84.03,89.88 v84.25,89.66 | SERIAL_PROGRAMMER.RXI 75.51,35.19 75.41,35.29 75.44,35.29 v75.66,35.51 | v76.58,37.43 76.51,37.43 73.49,40.45 73.49,45.58 | 73.49,45.58 73.49,45.99 73.38,46.1 73.31,46.1 71.46,47.95 62.92,47.95 U2.47 | v79.38,45.73 73.64,45.73 73.49,45.58
  Bottom 0.152: v75.66,35.51 75.66,36.04 76.87,37.25 76.76,37.25 v76.58,37.43 | v84.25,89.66 84.25,47.95 81.94,45.64 79.47,45.64 v79.38,45.73
TX1  (via drill 0.35)
  Top 0.152: U2.28 57.36,38.79 57.51,38.64 64.66,38.64 65.92,39.9 v68.36,39.91
  Bottom 0.152: SERIAL_DEBUGGER.RXI 91.7,42.27 93.41,40.57 93.41,40.01 92.33,38.93 70.06,38.93 69.09,39.9 v68.36,39.91
VBAT  (via drill 0.35)
  Top 0.152: D1.C 16.26,66.12 U$1.V+ 13.06,65.82 | U$9.3 65.26,93.47 64.7,94.03 | 64.7,94.03 R9.2 61.09,94.53 61.09,92.59 59.73,91.23 R3.2 56.4,90.94 | R4.2 56.21,91.13 56.4,90.94 | 13.06,65.82 13.06,63.55 13.16,63.45 14.89,63.45 v14.94,63.5 | v70.09,18.81 v70.08,18.8 70.08,18.68 70.09,18.67 70.09,18.11 69.17,17.19 D4.C 68.09,16.29 U$4.V+ 65.83,10.93 63.8,10.93 62.11,12.62 C8.1 | v64.35,114.37 64.89,114.91 64.89,115.62 65.21,115.94 D2.C 65.21,120.31 U$2.V+ 68.05,123.15 70.66,123.15 72.51,121.3 C25.1 | v114.84,70.61 116.18,70.61 117.09,69.7 D3.C 117.99,68.19 U$3.V+ 123.21,66.07 123.21,64.1 120.75,61.64 C24.1 | v66.91,94.43 v66.92,94.42 67.13,94.42 67.16,94.39 U$9.1 68.36,94.39 C18.1 70.01,94.14 70.01,91.83 70.69,91.15 C5.1 | v65.22,94.43 65.1,94.43 64.7,94.03 | R5.2 49.33,61.47 49.35,61.49 49.35,61.57 v49.41,61.63 | v45.48,65.96 45.48,69.85 45.37,69.96 | 45.37,69.96 45.16,70.17 39.09,70.17 BREAKOUT_HEADER.8 | 45.37,69.96 51.83,69.96 57.85,75.98 57.85,84.86 J2.1 57.83,87.99 56.86,88.96 56.86,90.48 56.4,90.94 | C7.1 13.76,72.36 11.53,70.13 11.53,67.35 13.06,65.82
  Route2 0.152: v14.94,63.5 18.08,63.5 18.14,63.56 | v70.09,18.81 70.09,20.94 69.72,21.31 | BREAKOUT_HEADER.8 36.81,70.76 35.69,71.88
  Route15 0.152: v64.35,114.37 64.35,112.15 64.3,112.1 64.3,112.16 64.32,112.18 | v114.84,70.61 112.05,70.61 | 112.05,70.61 112.04,70.62 | 112.05,70.61 112.05,72.86 110.68,74.23 102.32,74.23 99.76,76.79 86.92,76.79
  Bottom 0.152: v66.91,94.43 65.54,94.43 65.46,94.51 65.3,94.51 v65.22,94.43 | v49.41,61.63 49.41,61.74 45.48,65.67 v45.48,65.96
  pour Route2: 36.99,58.49 31.29,58.49 31.29,62.69 10.99,62.69 10.99,70.89 11.19,70.89 11.19,70.59 32.89,70.59 32.89,73.19 arc-90 62.69,102.99 63.29,102.99 63.29,122.99 71.09,122.99 71.09,102.89 71.49,102.89 arc-90 101.29,73.09 101.29,72.99 arc90 102.69,71.59 122.09,71.59 arc-90 122.89,70.79 122.89,63.59 arc-90 122.39,63.09 103.49,63.09 arc90 103.39,62.99 102.99,62.99 arc90 101.79,61.79 101.79,61.49 arc-90 71.19,30.89 71.19,15.29 arc-90 66.89,10.99 65.49,10.99 arc-90 62.89,13.59 62.89,26.99 arc-90 70.49,34.59 71.19,34.59 arc90 98.39,61.79 98.39,68.49 arc90 77.29,89.59 58.99,89.59 arc-90 54.29,94.29 48.99,94.29 arc90 36.49,81.79 36.49,59.99 arc90
VBAT_SENSE
  Top 0.152: 49.31,57.08 R6.2 | 49.31,57.08 49.23,57.07 R5.1 | 49.31,57.08 49.39,57.53 49.39,54.16 50.74,52.28 50.74,51.27 51.29,50.72 51.29,50.7 51.43,50.56 52.1,50.56 52.36,50.3 U2.63

### Text on the board
tPlate: HKN TEAM: / ANDREW S. / LUCAS T.